# Altium project Tray2.PrjPcb
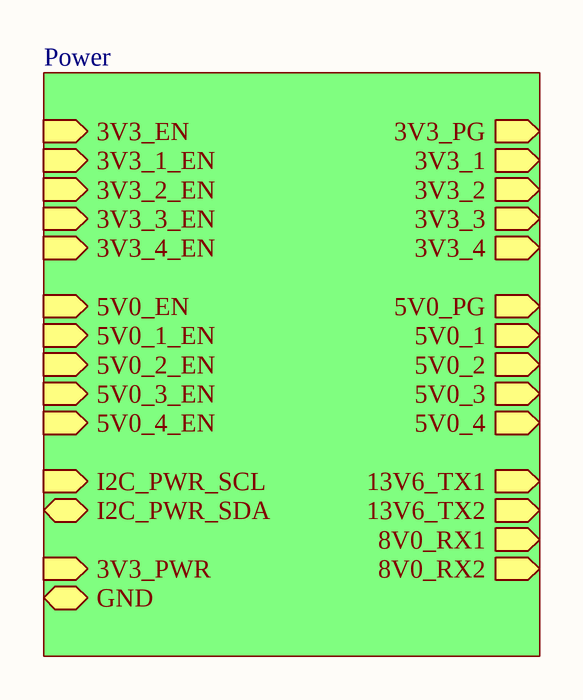
[diagram p0: Top.SchDoc]
7 sheets, 367 parts. Net scope: strictly hierarchical (ports join the sheet entries above them; power ports are local).
Sheets:
  Top.SchDoc
    Power = Power.SchDoc
      LDO_5V0_1 = LDO_Regulator.SchDoc
      LDO_3V3_1 = LDO_Regulator.SchDoc
      LDO_5V0_2 = LDO_Regulator.SchDoc
      LDO_3V3_2 = LDO_Regulator.SchDoc
      LDO_5V0_3 = LDO_Regulator.SchDoc
      LDO_3V3_3 = LDO_Regulator.SchDoc
      LDO_5V0_4 = LDO_Regulator.SchDoc
      LDO_3V3_4 = LDO_Regulator.SchDoc
      SW_5V0 = SW_Regulator.SchDoc
      SW_3V3 = SW_Regulator.SchDoc
      TRX1 = TRX_Regulator.SchDoc
      TRX2 = TRX_Regulator.SchDoc
      BCR = BCR.SchDoc
        X+ = BCR_Unit.SchDoc
        Y+ = BCR_Unit.SchDoc
        Z+ = BCR_Unit.SchDoc
        X- = BCR_Unit.SchDoc
        Y- = BCR_Unit.SchDoc
        Z- = BCR_Unit.SchDoc

## Sheet Top.SchDoc
size A4

### Sub-sheets
Power = Power.SchDoc: 5V0_1 (out), 3V3_1 (out), 5V0_2 (out), 3V3_2 (out), 5V0_3 (out), 3V3_3 (out), 5V0_4 (out), 3V3_4 (out), 5V0_PG (out), 3V3_PG (out), GND, 13V6_TX1 (out), 8V0_RX1 (out), 13V6_TX2 (out), 8V0_RX2 (out), 5V0_EN (in), 3V3_EN (in), 5V0_1_EN (in), 5V0_2_EN (in), 5V0_3_EN (in), 5V0_4_EN (in), 3V3_1_EN (in), 3V3_2_EN (in), 3V3_3_EN (in), 3V3_4_EN (in), I2C_PWR_SCL (in), I2C_PWR_SDA (bidir), 3V3_PWR (in)

## Sheet Power.SchDoc
size A3; Description: Power Subsystem; Version: 1.0
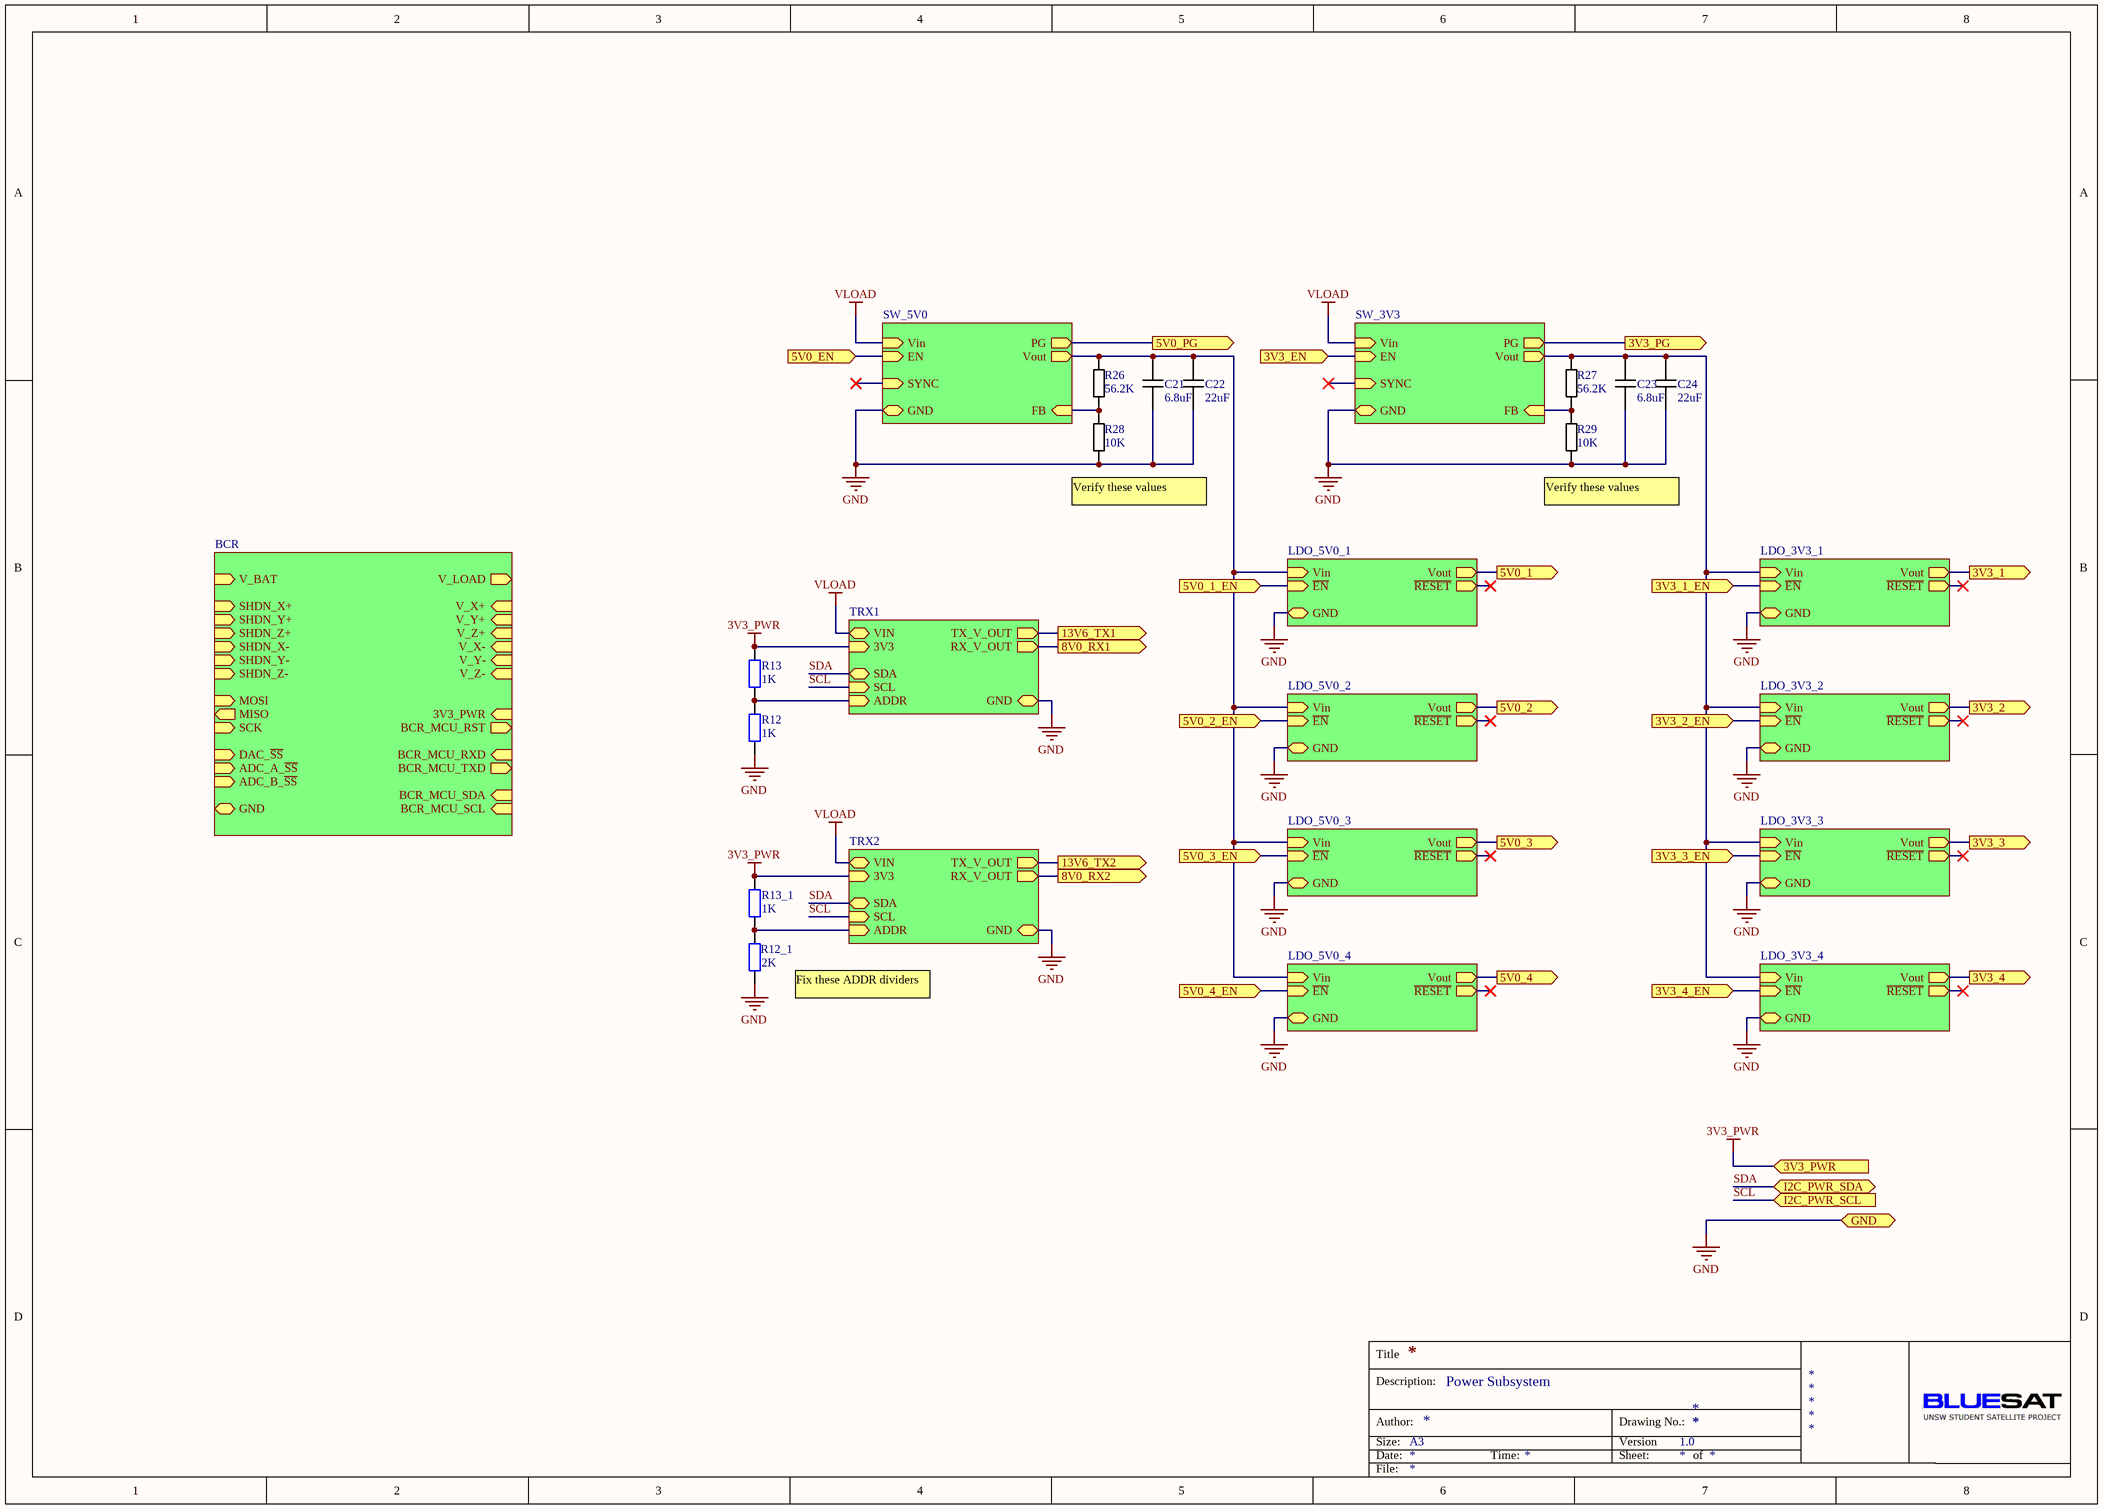
[diagram p1: Power.SchDoc]

### Parts
(Parts that share a designator on the sheet are numbered #1, #2 ... from top to bottom, then left to right.)
C21#1  value 6.8uF  [0805 Cap]  (hidden comment: 0805 Cap)
C22#1  value 22uF  [1206 Cap]  (hidden comment: 1206 Cap)
C23#1  value 6.8uF  [0805 Cap]  (hidden comment: 0805 Cap)
C24#1  value 22uF  [1206 Cap]  (hidden comment: 1206 Cap)
R12#1  value 1K  [R0805M]  (hidden comment: Res2)
R12_1  value 2K  [R0805M]  (hidden comment: Res2)
R13#1  value 1K  [R0805M]  (hidden comment: Res2)
R13_1  value 1K  [R0805M]  (hidden comment: Res2)
R26  value 56.2K  [0805 Resistor]  (hidden comment: 0805 Resistor)
R27  value 56.2K  [0805 Resistor]  (hidden comment: 0805 Resistor)
R28  value 10K  [0805 Resistor]  (hidden comment: 0805 Resistor)
R29  value 10K  [0805 Resistor]  (hidden comment: 0805 Resistor)

### Sub-sheets
BCR = BCR.SchDoc: 3V3_PWR (in), V_BAT (in), V_LOAD (out), V_X+ (in), V_Y+ (in), V_Z+ (in), V_X- (in), V_Y- (in), V_Z- (in), SHDN_X+ (in), SHDN_Y+ (in), SHDN_Z+ (in), SHDN_X- (in), SHDN_Y- (in), SHDN_Z- (in), MOSI (in), MISO (out), SCK (in), DAC_~{SS} (in), ADC_A_~{SS} (in), ADC_B_~{SS} (in), BCR_MCU_SDA (in), BCR_MCU_SCL (in), BCR_MCU_RXD (in), BCR_MCU_TXD (out), BCR_MCU_RST (out), GND
LDO_3V3_1 = LDO_Regulator.SchDoc: Vout (out), ~{EN} (in), ~{RESET} (out), Vin (in), GND
LDO_3V3_2 = LDO_Regulator.SchDoc: Vout (out), ~{EN} (in), ~{RESET} (out), Vin (in), GND
LDO_3V3_3 = LDO_Regulator.SchDoc: Vout (out), ~{EN} (in), ~{RESET} (out), Vin (in), GND
LDO_3V3_4 = LDO_Regulator.SchDoc: Vout (out), ~{EN} (in), ~{RESET} (out), Vin (in), GND
LDO_5V0_1 = LDO_Regulator.SchDoc: Vout (out), ~{EN} (in), ~{RESET} (out), Vin (in), GND
LDO_5V0_2 = LDO_Regulator.SchDoc: Vout (out), ~{EN} (in), ~{RESET} (out), Vin (in), GND
LDO_5V0_3 = LDO_Regulator.SchDoc: Vout (out), ~{EN} (in), ~{RESET} (out), Vin (in), GND
LDO_5V0_4 = LDO_Regulator.SchDoc: Vout (out), ~{EN} (in), ~{RESET} (out), Vin (in), GND
SW_3V3 = SW_Regulator.SchDoc: PG (out), Vout (out), EN (in), Vin (in), SYNC (in), GND, FB (in)
SW_5V0 = SW_Regulator.SchDoc: PG (out), Vout (out), EN (in), Vin (in), SYNC (in), GND, FB (in)
TRX1 = TRX_Regulator.SchDoc: VIN, TX_V_OUT (out), RX_V_OUT (out), 3V3 (in), SCL (in), SDA (bidir), GND, ADDR (in)
TRX2 = TRX_Regulator.SchDoc: VIN, TX_V_OUT (out), RX_V_OUT (out), 3V3 (in), SCL (in), SDA (bidir), GND, ADDR (in)

### Ports
3V3_1 (out), 3V3_1_EN (in), 3V3_2 (out), 3V3_2_EN (in), 3V3_3 (out), 3V3_3_EN (in), 3V3_4 (out), 3V3_4_EN (in), 3V3_EN (in), 3V3_PG (out), 3V3_PWR (in), 5V0_1 (out), 5V0_1_EN (in), 5V0_2 (out), 5V0_2_EN (in), 5V0_3 (out), 5V0_3_EN (in), 5V0_4 (out), 5V0_4_EN (in), 5V0_EN (in), 5V0_PG (out), 8V0_RX1 (out), 8V0_RX2 (out), 13V6_TX1 (out), 13V6_TX2 (out), GND, I2C_PWR_SCL (in), I2C_PWR_SDA (bidir)

### Nets
3V3_PWR: R13#1.2 R13_1.2 ; port 3V3_PWR, sheet TRX1/3V3, sheet TRX2/3V3
GND: C21#1.1 C22#1.1 C23#1.1 C24#1.1 R12#1.1 R12_1.1 R28.1 R29.1 ; port GND, sheet LDO_5V0_1/GND, sheet LDO_3V3_1/GND, sheet LDO_5V0_2/GND, sheet LDO_3V3_2/GND, sheet LDO_5V0_3/GND, sheet LDO_3V3_3/GND, sheet LDO_5V0_4/GND, sheet LDO_3V3_4/GND, sheet SW_5V0/GND, sheet SW_3V3/GND, sheet TRX1/GND, sheet TRX2/GND
VLOAD: sheet SW_5V0/Vin, sheet SW_3V3/Vin, sheet TRX1/VIN, sheet TRX2/VIN  [project net V_IN]
EN_SW_3V3: port 3V3_EN, sheet SW_3V3/EN
EN_SW_5V0: port 5V0_EN, sheet SW_5V0/EN
FB: R26.1 R28.2 ; sheet SW_5V0/FB
FB: R27.1 R29.2 ; sheet SW_3V3/FB  [a separate net that carries the same name]
PG_SW_3V3: port 3V3_PG, sheet SW_3V3/PG
PG_SW_5V0: port 5V0_PG, sheet SW_5V0/PG
RX_V_OUT_TRX1: port 8V0_RX1, sheet TRX1/RX_V_OUT
RX_V_OUT_TRX2: port 8V0_RX2, sheet TRX2/RX_V_OUT
SCL: port I2C_PWR_SCL, sheet TRX1/SCL, sheet TRX2/SCL
SDA: port I2C_PWR_SDA, sheet TRX1/SDA, sheet TRX2/SDA
TX_V_OUT_TRX1: port 13V6_TX1, sheet TRX1/TX_V_OUT
TX_V_OUT_TRX2: port 13V6_TX2, sheet TRX2/TX_V_OUT
Vout: C21#1.2 C22#1.2 R26.2 ; sheet LDO_5V0_1/Vin, sheet LDO_5V0_2/Vin, sheet LDO_5V0_3/Vin, sheet LDO_5V0_4/Vin, sheet SW_5V0/Vout
Vout: C23#1.2 C24#1.2 R27.2 ; sheet LDO_3V3_1/Vin, sheet LDO_3V3_2/Vin, sheet LDO_3V3_3/Vin, sheet LDO_3V3_4/Vin, sheet SW_3V3/Vout  [a separate net that carries the same name]
NetC2_LDO_3V3_1_2: port 3V3_1, sheet LDO_3V3_1/Vout
NetC2_LDO_3V3_2_2: port 3V3_2, sheet LDO_3V3_2/Vout
NetC2_LDO_3V3_3_2: port 3V3_3, sheet LDO_3V3_3/Vout
NetC2_LDO_3V3_4_2: port 3V3_4, sheet LDO_3V3_4/Vout
NetC2_LDO_5V0_1_2: port 5V0_1, sheet LDO_5V0_1/Vout
NetC2_LDO_5V0_2_2: port 5V0_2, sheet LDO_5V0_2/Vout
NetC2_LDO_5V0_3_2: port 5V0_3, sheet LDO_5V0_3/Vout
NetC2_LDO_5V0_4_2: port 5V0_4, sheet LDO_5V0_4/Vout
NetR12#1_2: R12#1.2 R13#1.1 ; sheet TRX1/ADDR
NetR12_1_2: R12_1.2 R13_1.1 ; sheet TRX2/ADDR
NetU1_LDO_3V3_1_5: port 3V3_1_EN, sheet LDO_3V3_1/~{EN}
NetU1_LDO_3V3_2_5: port 3V3_2_EN, sheet LDO_3V3_2/~{EN}
NetU1_LDO_3V3_3_5: port 3V3_3_EN, sheet LDO_3V3_3/~{EN}
NetU1_LDO_3V3_4_5: port 3V3_4_EN, sheet LDO_3V3_4/~{EN}
NetU1_LDO_5V0_1_5: port 5V0_1_EN, sheet LDO_5V0_1/~{EN}
NetU1_LDO_5V0_2_5: port 5V0_2_EN, sheet LDO_5V0_2/~{EN}
NetU1_LDO_5V0_3_5: port 5V0_3_EN, sheet LDO_5V0_3/~{EN}
NetU1_LDO_5V0_4_5: port 5V0_4_EN, sheet LDO_5V0_4/~{EN}

### Notes on the sheet
- (near R28) Verify these values
- (near R29) Verify these values
- (near R12_1) Fix these ADDR dividers
- Title
- Description:
- Size:
- Author:
- Date:
- A3
- Time:
- Version
- Sheet:
- Drawing No.:
- of
- File:

### Library data of the parts
C21#1 C23#1 = 0805 MLCC - X7R, 10%
C22#1 C24#1 = 1206 MLCC - X7R, 10%
R12#1 R12_1 R13#1 R13_1 = Res2: Resistor; Published: 8-Jun-2000; LatestRevisionDate: 17-Jul-2002; LatestRevisionNote: Re-released for DXP Platform.; PackageReference: AXIAL-0.4; Publisher: Altium Limited
R26-R29 = 0805 Thick Film Resistor 1%

## Sheet LDO_Regulator.SchDoc: 3V3/5V0 Low Drop Out Linear Regulator
size A3; Description: Based on LDO-BASE.SchDoc SVN Rev 73; Version: 1.0
Used 8 times, as channels Power/LDO_5V0_1, Power/LDO_3V3_1, Power/LDO_5V0_2, Power/LDO_3V3_2, Power/LDO_5V0_3, Power/LDO_3V3_3, Power/LDO_5V0_4, Power/LDO_3V3_4. Parts and nets are listed once, with the designators drawn on the sheet.
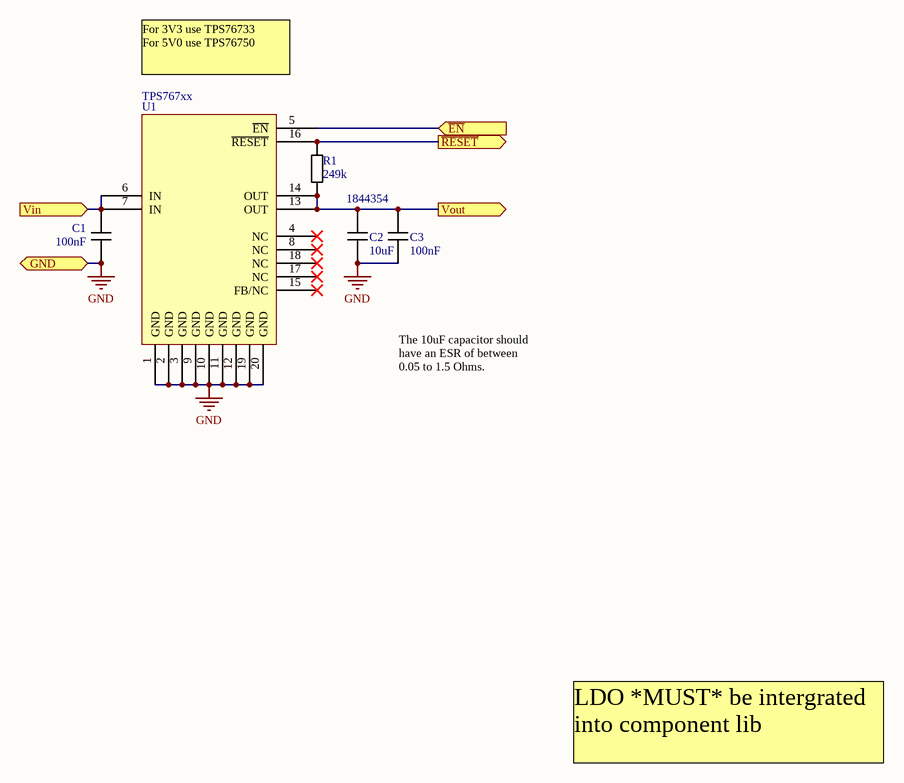
[diagram p2: LDO_Regulator.SchDoc]

### Parts
C1  value 100nF  [0805 Cap]  (hidden comment: 0805 Cap)
C2  value 10uF  Supplier Part Number 1: 1844354  [1210 Cap]  (hidden comment: 1210 Cap)
C3  value 100nF  [0805 Cap]  (hidden comment: 0805 Cap)
R1  value 249k  [0805 Resistor]  (hidden comment: 0805 Resistor)
U1  TPS767xx  [SOP-20 TPS76700]

### Ports
GND, Vin (in), Vout (out), ~{EN} (in), ~{RESET} (out)

### Nets
GND: C1.1 C2.1 C3.1 U1.1(GND) U1.2(GND) U1.3(GND) U1.9(GND) U1.10(GND) U1.11(GND) U1.12(GND) U1.19(GND) U1.20(GND) ; port GND
~{EN}: U1.5(~{EN}) ; port ~{EN}
~{RESET}: R1.2 U1.16(~{RESET}) ; port ~{RESET}
Vin: C1.2 U1.6(IN) U1.7(IN) ; port Vin
Vout: C2.2 C3.2 R1.1 U1.13(OUT) U1.14(OUT) ; port Vout

Not connected (* = marked no-connect by the designer): U1 4(NC)* 8(NC)* 15(FB/NC)* 17(NC)* 18(NC)*

### Channels
Power/LDO_5V0_1: designators end in _LDO_5V0_1; ports GND=GND Vin=Vout Vout=NetC2_LDO_5V0_1_2 ~{EN}=NetU1_LDO_5V0_1_5 ~{RESET}=NetR1_LDO_5V0_1_2
Power/LDO_3V3_1: designators end in _LDO_3V3_1; ports GND=GND Vin=Vout Vout=NetC2_LDO_3V3_1_2 ~{EN}=NetU1_LDO_3V3_1_5 ~{RESET}=NetR1_LDO_3V3_1_2
Power/LDO_5V0_2: designators end in _LDO_5V0_2; ports GND=GND Vin=Vout Vout=NetC2_LDO_5V0_2_2 ~{EN}=NetU1_LDO_5V0_2_5 ~{RESET}=NetR1_LDO_5V0_2_2
Power/LDO_3V3_2: designators end in _LDO_3V3_2; ports GND=GND Vin=Vout Vout=NetC2_LDO_3V3_2_2 ~{EN}=NetU1_LDO_3V3_2_5 ~{RESET}=NetR1_LDO_3V3_2_2
Power/LDO_5V0_3: designators end in _LDO_5V0_3; ports GND=GND Vin=Vout Vout=NetC2_LDO_5V0_3_2 ~{EN}=NetU1_LDO_5V0_3_5 ~{RESET}=NetR1_LDO_5V0_3_2
Power/LDO_3V3_3: designators end in _LDO_3V3_3; ports GND=GND Vin=Vout Vout=NetC2_LDO_3V3_3_2 ~{EN}=NetU1_LDO_3V3_3_5 ~{RESET}=NetR1_LDO_3V3_3_2
Power/LDO_5V0_4: designators end in _LDO_5V0_4; ports GND=GND Vin=Vout Vout=NetC2_LDO_5V0_4_2 ~{EN}=NetU1_LDO_5V0_4_5 ~{RESET}=NetR1_LDO_5V0_4_2
Power/LDO_3V3_4: designators end in _LDO_3V3_4; ports GND=GND Vin=Vout Vout=NetC2_LDO_3V3_4_2 ~{EN}=NetU1_LDO_3V3_4_5 ~{RESET}=NetR1_LDO_3V3_4_2

### Notes on the sheet
- For 3V3 use TPS76733
  For 5V0 use TPS76750
- The 10uF capacitor should have an ESR of between 0.05 to 1.5 Ohms.
- LDO *MUST* be intergrated into component lib
- Title
- Description:
- Size:
- Author:
- Date:
- A3
- Time:
- Version
- Sheet:
- Drawing No.:
- of
- File:

### Library data of the parts
C1 C3 = 0805 MLCC - X7R, 10%
C2 = 1210 MLCC - X7R, 10%: Supplier 1: Farnell
R1 = 0805 Thick Film Resistor 1%
U1 = TPS76700: LDO Regulator - ER; Supplier 1: Farnell; Supplier Part Number 1: 1135436; Supplier 2: Farnell; Supplier Part Number 2: 1135435

## Sheet SW_Regulator.SchDoc: 5V/3V3 Switching Regulator LV
size A3; Description: Based on Switching_Regulator_LV.SchDoc SVN Rev 73; Version: 1.0
Used 2 times, as channels Power/SW_5V0, Power/SW_3V3. Parts and nets are listed once, with the designators drawn on the sheet.
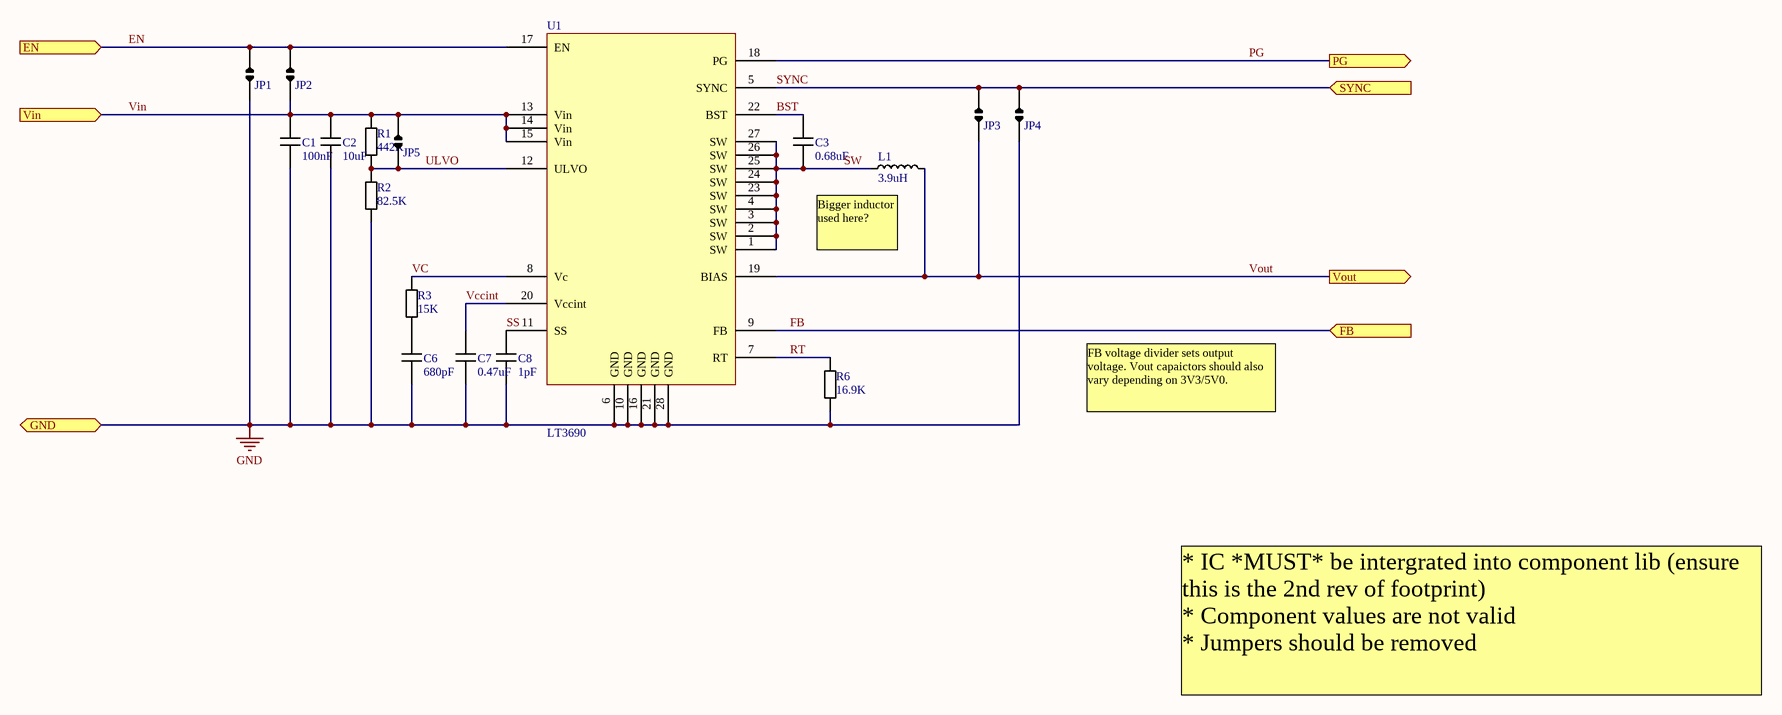
[diagram p3: SW_Regulator.SchDoc]

### Parts
C1  value 100nF  [0805 Cap]  (hidden comment: 0805 Cap)
C2  value 10uF  [1206 Cap]  (hidden comment: 1206 Cap)
C3  value 0.68uF  [0805 Cap]  (hidden comment: 0805 Cap)
C6  value 680pF  [0805 Cap]  (hidden comment: 0805 Cap)
C7  value 0.47uF  [0805 Cap]  (hidden comment: 0805 Cap)
C8  value 1pF  [0805 Cap]  (hidden comment: 0805 Cap)
JP1  Jumper  [Solder Jumper C]  (value not drawn)
JP2  Jumper  [Solder Jumper C]  (value not drawn)
JP3  Jumper  [Solder Jumper C]  (value not drawn)
JP4  Jumper  [Solder Jumper C]  (value not drawn)
JP5  Jumper  [Solder Jumper C]  (value not drawn)
L1  value 3.9uH  [INDP4037X16N]  (hidden comment: LQH44PN2R2MP0)
R1  value 442K  [0805 Resistor]  (hidden comment: 0805 Resistor)
R2  value 82.5K  [0805 Resistor]  (hidden comment: 0805 Resistor)
R3  value 15K  [0805 Resistor]  (hidden comment: 0805 Resistor)
R6  value 16.9K  [0805 Resistor]  (hidden comment: 0805 Resistor)
U1  LT3690  [LT3690]

### Ports
EN (in), FB (in), GND, PG (out), SYNC (in), Vin (in), Vout (out)

### Nets
GND: C1.1 C2.1 C6.1 C7.1 C8.1 JP1.2 JP4.2 R2.1 R6.1 U1.6(GND) U1.10(GND) U1.16(GND) U1.21(GND) U1.28(GND) ; port GND
BST: C3.2 U1.22(BST)
EN: JP1.1 JP2.1 U1.17(EN) ; port EN
FB: U1.9(FB) ; port FB
PG: U1.18(PG) ; port PG
RT: R6.2 U1.7(RT)
SS: C8.2 U1.11(SS)
SW: C3.1 L1.1 U1.1(SW) U1.2(SW) U1.3(SW) U1.4(SW) U1.23(SW) U1.24(SW) U1.25(SW) U1.26(SW) U1.27(SW)
SYNC: JP3.1 JP4.1 U1.5(SYNC) ; port SYNC
ULVO: JP5.2 R1.1 R2.2 U1.12(ULVO)
VC: R3.2 U1.8(Vc)
Vccint: C7.2 U1.20(Vccint)
Vin: C1.2 C2.2 JP2.2 JP5.1 R1.2 U1.13(Vin) U1.14(Vin) U1.15(Vin) ; port Vin
Vout: JP3.2 L1.2 U1.19(BIAS) ; port Vout
NetC6_2: C6.2 R3.1

### Channels
Power/SW_5V0: designators end in _SW_5V0; ports EN=EN_SW_5V0 FB=FB GND=GND PG=PG_SW_5V0 SYNC=SYNC_SW_5V0 Vin=V_IN Vout=Vout
Power/SW_3V3: designators end in _SW_3V3; ports EN=EN_SW_3V3 FB=FB GND=GND PG=PG_SW_3V3 SYNC=SYNC_SW_3V3 Vin=V_IN Vout=Vout

### Notes on the sheet
- (near L1) Bigger inductor used here?
- FB voltage divider sets output voltage. Vout capaictors should also vary depending on 3V3/5V0.
- * IC *MUST* be intergrated into component lib (ensure this is the 2nd rev of footprint)
  * Component values are not valid
  * Jumpers should be removed
- Title
- Description:
- Size:
- Author:
- Date:
- A3
- Time:
- Version
- Sheet:
- Drawing No.:
- of
- File:

### Library data of the parts
C1 C3 C7 = 0805 MLCC - X7R, 10%
C2 = 1206 MLCC - X7R, 10%
C6 C8 = 0805 MLCC - NP0, 5%
JP1-JP5 = Solder Bridge
L1 = LQH44PN2R2MP0: Inductor 4x4mm 2.2uH; ComponentLink1Description: Datasheet; ComponentLink1URL: http://search.murata.co.jp/Ceramy/image/img/PDF/ENG/L0075S0103LQH44P.pdf
R1-R3 R6 = 0805 Thick Film Resistor 1%

## Sheet TRX_Regulator.SchDoc: TX & RX Radio Pair Regulator
size A3; Engineer: C. BROWN; Organization: BLUEsat Project; Address1: Room 419; Address2: School of EE&T; Address3: UNSW, NSW 2052; Address4: Australia; DocumentNumber: TITL0002; SheetNumber: 1; SheetTotal: 1; Description: Based on POWR0009.SchDoc SVN Rev 93; Version: 2.0
Used 2 times, as channels Power/TRX1, Power/TRX2. Parts and nets are listed once, with the designators drawn on the sheet.
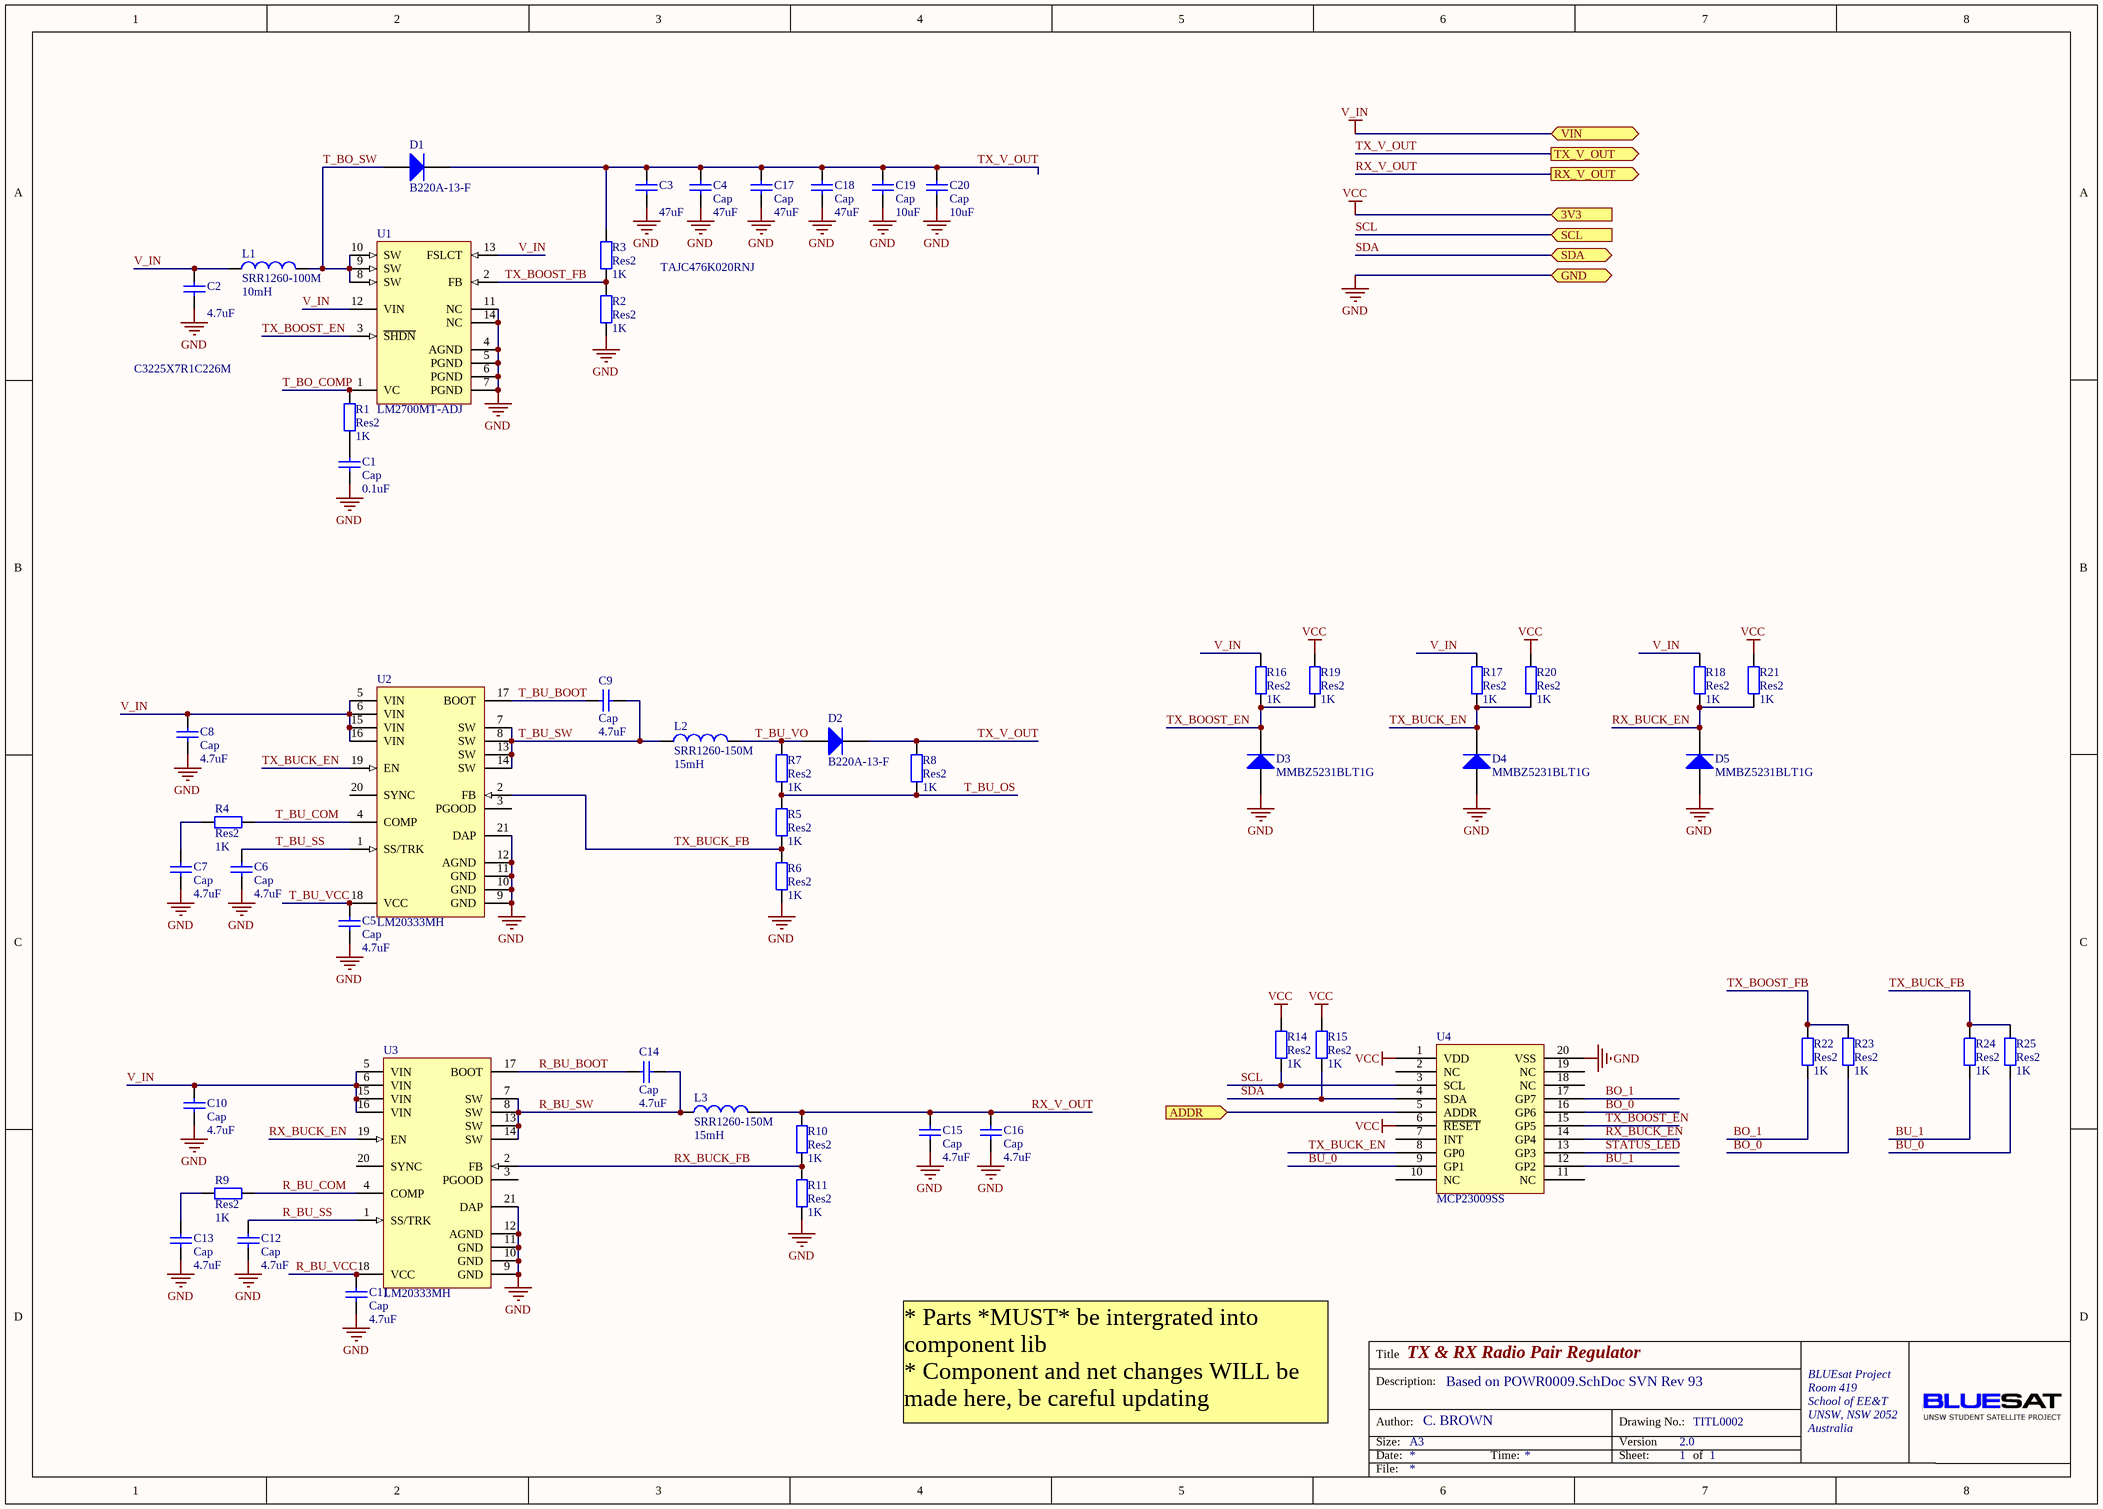
[diagram p4: TRX_Regulator.SchDoc]

### Parts
C1  Cap  value 0.1uF  [R0805M]
C2  C3225X7R1C226M  value 4.7uF  [R1210M]
C3  TAJC476K020RNJ  value 47uF  [TANTCASEC]
C4  Cap  value 47uF  [TANTCASEC]
C5  Cap  value 4.7uF  [R0805M]
C6  Cap  value 4.7uF  [R0805M]
C7  Cap  value 4.7uF  [R0805M]
C8  Cap  value 4.7uF  [R1210M]
C9  Cap  value 4.7uF  [R0805M]
C10  Cap  value 4.7uF  [R1210M]
C11  Cap  value 4.7uF  [R0805M]
C12  Cap  value 4.7uF  [R0805M]
C13  Cap  value 4.7uF  [R0805M]
C14  Cap  value 4.7uF  [R0805M]
C15  Cap  value 4.7uF  [R0805M]
C16  Cap  value 4.7uF  [R0805M]
C17  Cap  value 47uF  [TANTCASEC]
C18  Cap  value 47uF  [TANTCASEC]
C19  Cap  value 10uF  [R0805M]
C20  Cap  value 10uF  [R0805M]
D1  B220A-13-F  [DIODESMA]
D2  B220A-13-F  [DIODESMA]
D3  MMBZ5231BLT1G  [SOT95P240-3N]
D4  MMBZ5231BLT1G  [SOT95P240-3N]
D5  MMBZ5231BLT1G  [SOT95P240-3N]
L1  SRR1260-100M  value 10mH  [SRR1260M]
L2  SRR1260-150M  value 15mH  [SRR1260M]
L3  SRR1260-150M  value 15mH  [SRR1260M]
R1  Res2  value 1K  [R0805M]
R2  Res2  value 1K  [R0805M]
R3  Res2  value 1K  [R0805M]
R4  Res2  value 1K  [R0805M]
R5  Res2  value 1K  [R0805M]
R6  Res2  value 1K  [R0805M]
R7  Res2  value 1K  [R0805M]
R8  Res2  value 1K  [R0805M]
R9  Res2  value 1K  [R0805M]
R10  Res2  value 1K  [R0805M]
R11  Res2  value 1K  [R0805M]
R14  Res2  value 1K  [R0805M]
R15  Res2  value 1K  [R0805M]
R16  Res2  value 1K  [R0805M]
R17  Res2  value 1K  [R0805M]
R18  Res2  value 1K  [R0805M]
R19  Res2  value 1K  [R0805M]
R20  Res2  value 1K  [R0805M]
R21  Res2  value 1K  [R0805M]
R22  Res2  value 1K  [R0805M]
R23  Res2  value 1K  [R0805M]
R24  Res2  value 1K  [R0805M]
R25  Res2  value 1K  [R0805M]
U1  LM2700MT-ADJ  [MTC14_N]
U2  LM20333MH  [MXA20A_N]
U3  LM20333MH  [MXA20A_N]
U4  MCP23009SS  [SSOP-SS20_M]

### Ports
3V3 (in), ADDR (in), GND, RX_V_OUT (out), SCL (in), SDA (bidir), TX_V_OUT (out), VIN

### Nets
GND: C1.1 C2.1 C3.1 C4.1 C5.1 C6.1 C7.1 C8.1 C10.1 C11.1 C12.1 C13.1 C15.1 C16.1 C17.1 C18.1 C19.1 C20.1 D3.1(A) D4.1(A) D5.1(A) R2.1 R6.2 R11.1 U1.4(AGND) U1.5(PGND) U1.6(PGND) U1.7(PGND) U1.11(NC) U1.14(NC) U2.9(GND) U2.10(GND) U2.11(GND) U2.12(AGND) U2.21(DAP) U3.9(GND) U3.10(GND) U3.11(GND) U3.12(AGND) U3.21(DAP) U4.20(VSS) ; port GND
V_IN: C2.2 C8.2 C10.2 L1.1 R16.2 R17.2 R18.2 U1.12(VIN) U1.13(FSLCT) U2.5(VIN) U2.6(VIN) U2.15(VIN) U2.16(VIN) U3.5(VIN) U3.6(VIN) U3.15(VIN) U3.16(VIN) ; port VIN
VCC: R14.2 R15.2 R19.2 R20.2 R21.2 U4.1(VDD) U4.6(~{RESET}) ; port 3V3
ADDR: U4.5(ADDR) ; port ADDR
BO_0: R23.1 U4.16(GP6)
BO_1: R22.1 U4.17(GP7)
BU_0: R25.1 U4.9(GP1)
BU_1: R24.1 U4.12(GP2)
R_BU_BOOT: C14.1 U3.17(BOOT)
R_BU_COM: R9.1 U3.4(COMP)
R_BU_SS: C12.2 U3.1(SS/TRK)
R_BU_SW: C14.2 L3.1 U3.7(SW) U3.8(SW) U3.13(SW) U3.14(SW)
R_BU_VCC: C11.2 U3.18(VCC)
RX_BUCK_EN: D5.3(K) R18.1 R21.1 U3.19(EN) U4.14(GP4)
RX_BUCK_FB: R10.1 R11.2 U3.2(FB)
RX_V_OUT: C15.2 C16.2 L3.2 R10.2 ; port RX_V_OUT
SCL: R14.1 U4.3(SCL) ; port SCL
SDA: R15.1 U4.4(SDA) ; port SDA
STATUS_LED: U4.13(GP3)
T_BO_COMP: R1.2 U1.1(VC)
T_BO_SW: D1.1(A) L1.2 U1.8(SW) U1.9(SW) U1.10(SW)
T_BU_BOOT: C9.2 U2.17(BOOT)
T_BU_COM: R4.1 U2.4(COMP)
T_BU_OS: R5.1 R7.2 R8.2
T_BU_SS: C6.2 U2.1(SS/TRK)
T_BU_SW: C9.1 L2.1 U2.7(SW) U2.8(SW) U2.13(SW) U2.14(SW)
T_BU_VCC: C5.2 U2.18(VCC)
T_BU_VO: D2.1(A) L2.2 R7.1
TX_BOOST_EN: D3.3(K) R16.1 R19.1 U1.3(~{SHDN}) U4.15(GP5)
TX_BOOST_FB: R2.2 R3.1 R22.2 R23.2 U1.2(FB)
TX_BUCK_EN: D4.3(K) R17.1 R20.1 U2.19(EN) U4.8(GP0)
TX_BUCK_FB: R5.2 R6.1 R24.2 R25.2 U2.2(FB)
TX_V_OUT: C3.2 C4.2 C17.2 C18.2 C19.2 C20.2 D1.2(K) D2.2(K) R3.2 R8.1 ; port TX_V_OUT
NetC1_2: C1.2 R1.1
NetC7_2: C7.2 R4.2
NetC13_2: C13.2 R9.2

Not connected (* = marked no-connect by the designer): U2 3(PGOOD) 20(SYNC); U3 3(PGOOD) 20(SYNC); U4 2(NC) 7(INT) 10(NC) 11(NC) 18(NC) 19(NC)

### Channels
Power/TRX1: designators end in _TRX1; ports 3V3=3V3_PWR ADDR=NetR12#1_2 GND=GND RX_V_OUT=RX_V_OUT_TRX1 SCL=SCL SDA=SDA TX_V_OUT=TX_V_OUT_TRX1 VIN=V_IN
Power/TRX2: designators end in _TRX2; ports 3V3=3V3_PWR ADDR=NetR12_1_2 GND=GND RX_V_OUT=RX_V_OUT_TRX2 SCL=SCL SDA=SDA TX_V_OUT=TX_V_OUT_TRX2 VIN=V_IN

### Notes on the sheet
- Title
- Description:
- * Parts *MUST* be intergrated into component lib
  * Component and net changes WILL be made here, be careful updating
- Size:
- Author:
- Date:
- A3
- Time:
- Version
- Sheet:
- Drawing No.:
- of
- File:

### Library data of the parts
C1-C20 = Cap: Capacitor; Published: 8-Jun-2000; LatestRevisionDate: 17-Jul-2002; LatestRevisionNote: Re-released for DXP Platform.; PackageReference: RAD-0.3; Publisher: Altium Limited
D1 D2 = Diode 1N4148: High Conductance Fast Diode; Published: 8-Jun-2000; LatestRevisionDate: 17-Jul-2002; LatestRevisionNote: Re-released for DXP Platform.; DatasheetVersion: 1997; PackageReference: DO-35; Publisher: Altium Limited; Code_JEDEC: DO-204-AH; ComponentLink1Description: Manufacturer Link; ComponentLink1URL: http://www.fairchildsemi.com/; ComponentLink2Description: Datasheet; ComponentLink2URL: http://www.fairchildsemi.com/ds/1N%2F1N4148.pdf
D3-D5 = Diode BAS16: Silicon Switching Diode for High-Speed Switching; Note: Pin 2 is not connected and not drawn.; Published: 21-Mar-2003; LatestRevisionDate: 29-May-2009; LatestRevisionNote: IPC-7351 Footprint Added.; DatasheetVersion: Oct-1999; PackageVersion: Sep-2001; PackageReference: SOT-23; Publisher: Altium Limited; PackageDescription: 3-Pin SOT-23 Package 0.95 mm Pitch, 2.5 mm Lead Span; ComponentLink1Description: Manufacturer Link; ComponentLink1URL: http://www.infineon.com/; ComponentLink2Description: Datasheet; ComponentLink2URL: http://www.infineon.com/upload/Document/cmc_upload/documents/012/5331/bas16series.pdf
L1-L3 = Inductor: Code_IEC: 1005; Published: 8-Jun-2000; LatestRevisionDate: 29-May-2009; LatestRevisionNote: IPC-7351 Footprint Added.; PackageReference: 0402-A; Publisher: Altium Limited; PackageDescription: Chip Inductor; Code_JEITA: 0402
R1-R11 R14-R25 = Res2: Resistor; Published: 8-Jun-2000; LatestRevisionDate: 17-Jul-2002; LatestRevisionNote: Re-released for DXP Platform.; PackageReference: AXIAL-0.4; Publisher: Altium Limited
U1 = LM2700MT-ADJ: 600kHz/1.25MHz, 2.5A, Step-up PWM DC/DC Converter; Manufacturer: National Semiconductor; CompType: Switcher; PackageTopMarking: NSZXYTT*2700MT*-ADJ; PowerWise: N; Published: 4-Dec-2008; DatasheetVersion: May-2004; PackageVersion: revD, Jun-2003; PackageReference: MTC14; Publisher: Altium Limited; PackageDescription: Molded TSSOP, JEDEC, 5 x 4.4 x 0.9mm Body, 14 Lead, 0.65mm Pitch; PartNumber: LM2700MT-ADJ; RoHS: O; PinCount: 14; DigiKeyPartNumber: LM2700MT-ADJ-ND; Code_JEDEC: MO-153-AB-1; ComponentLink1Description: LM2700 Datasheet; ComponentLink1URL: http://www.national.com/ds/LM/LM2700.pdf; ComponentLink2Description: LM2700 Web Page; ComponentLink2URL: http://www.national.com/pf/LM/LM2700.html; ComponentLink3Description: MTC14 Package Drawing; ComponentLink3URL: http://www.national.com/packaging/folders/mtc14.html
U2 U3 = LM20333MH: 36V, 3A PowerWise Synchronous Buck Regulator with Frequency Synchronization; Manufacturer: National Semiconductor; CompType: Switcher; PackageTopMarking: NSUZXYTT*20333MH; Published: 4-Dec-2008; DatasheetVersion: Jun-2008; PackageVersion: revC, Jul-2006; PackageReference: MXA20A; Publisher: Altium Limited; PackageDescription: Molded TSSOP, Jedec, 6.5 x 4.4 x 0.9mm Body, 20 Lead, 0.65mm Pitch, Exposed Pad; PartNumber: LM20333MH; RoHS: Y; PinCount: 20; DigiKeyPartNumber: LM20333MH-ND; Code_JEDEC: MO-153-ACT; ComponentLink1Description: LM20333 Datasheet; ComponentLink1URL: http://www.national.com/ds/LM/LM20333.pdf; ComponentLink2Description: LM20333 Web Page; ComponentLink2URL: http://www.national.com/pf/LM/LM20333.html; ComponentLink3Description: MXA20A Package Drawing; ComponentLink3URL: http://www.national.com/packaging/folders/mxa20a.html

## Sheet BCR.SchDoc: BLUEsat Battery Charge Regulator System
size A3; Engineer: Thomas Fisk; Organization: BLUEsat Project; DocumentNumber: POWR0008; SheetNumber: 1; SheetTotal: 1; Description: Controls charging of batteries, MPPT, provides telem data; Version: 1.0
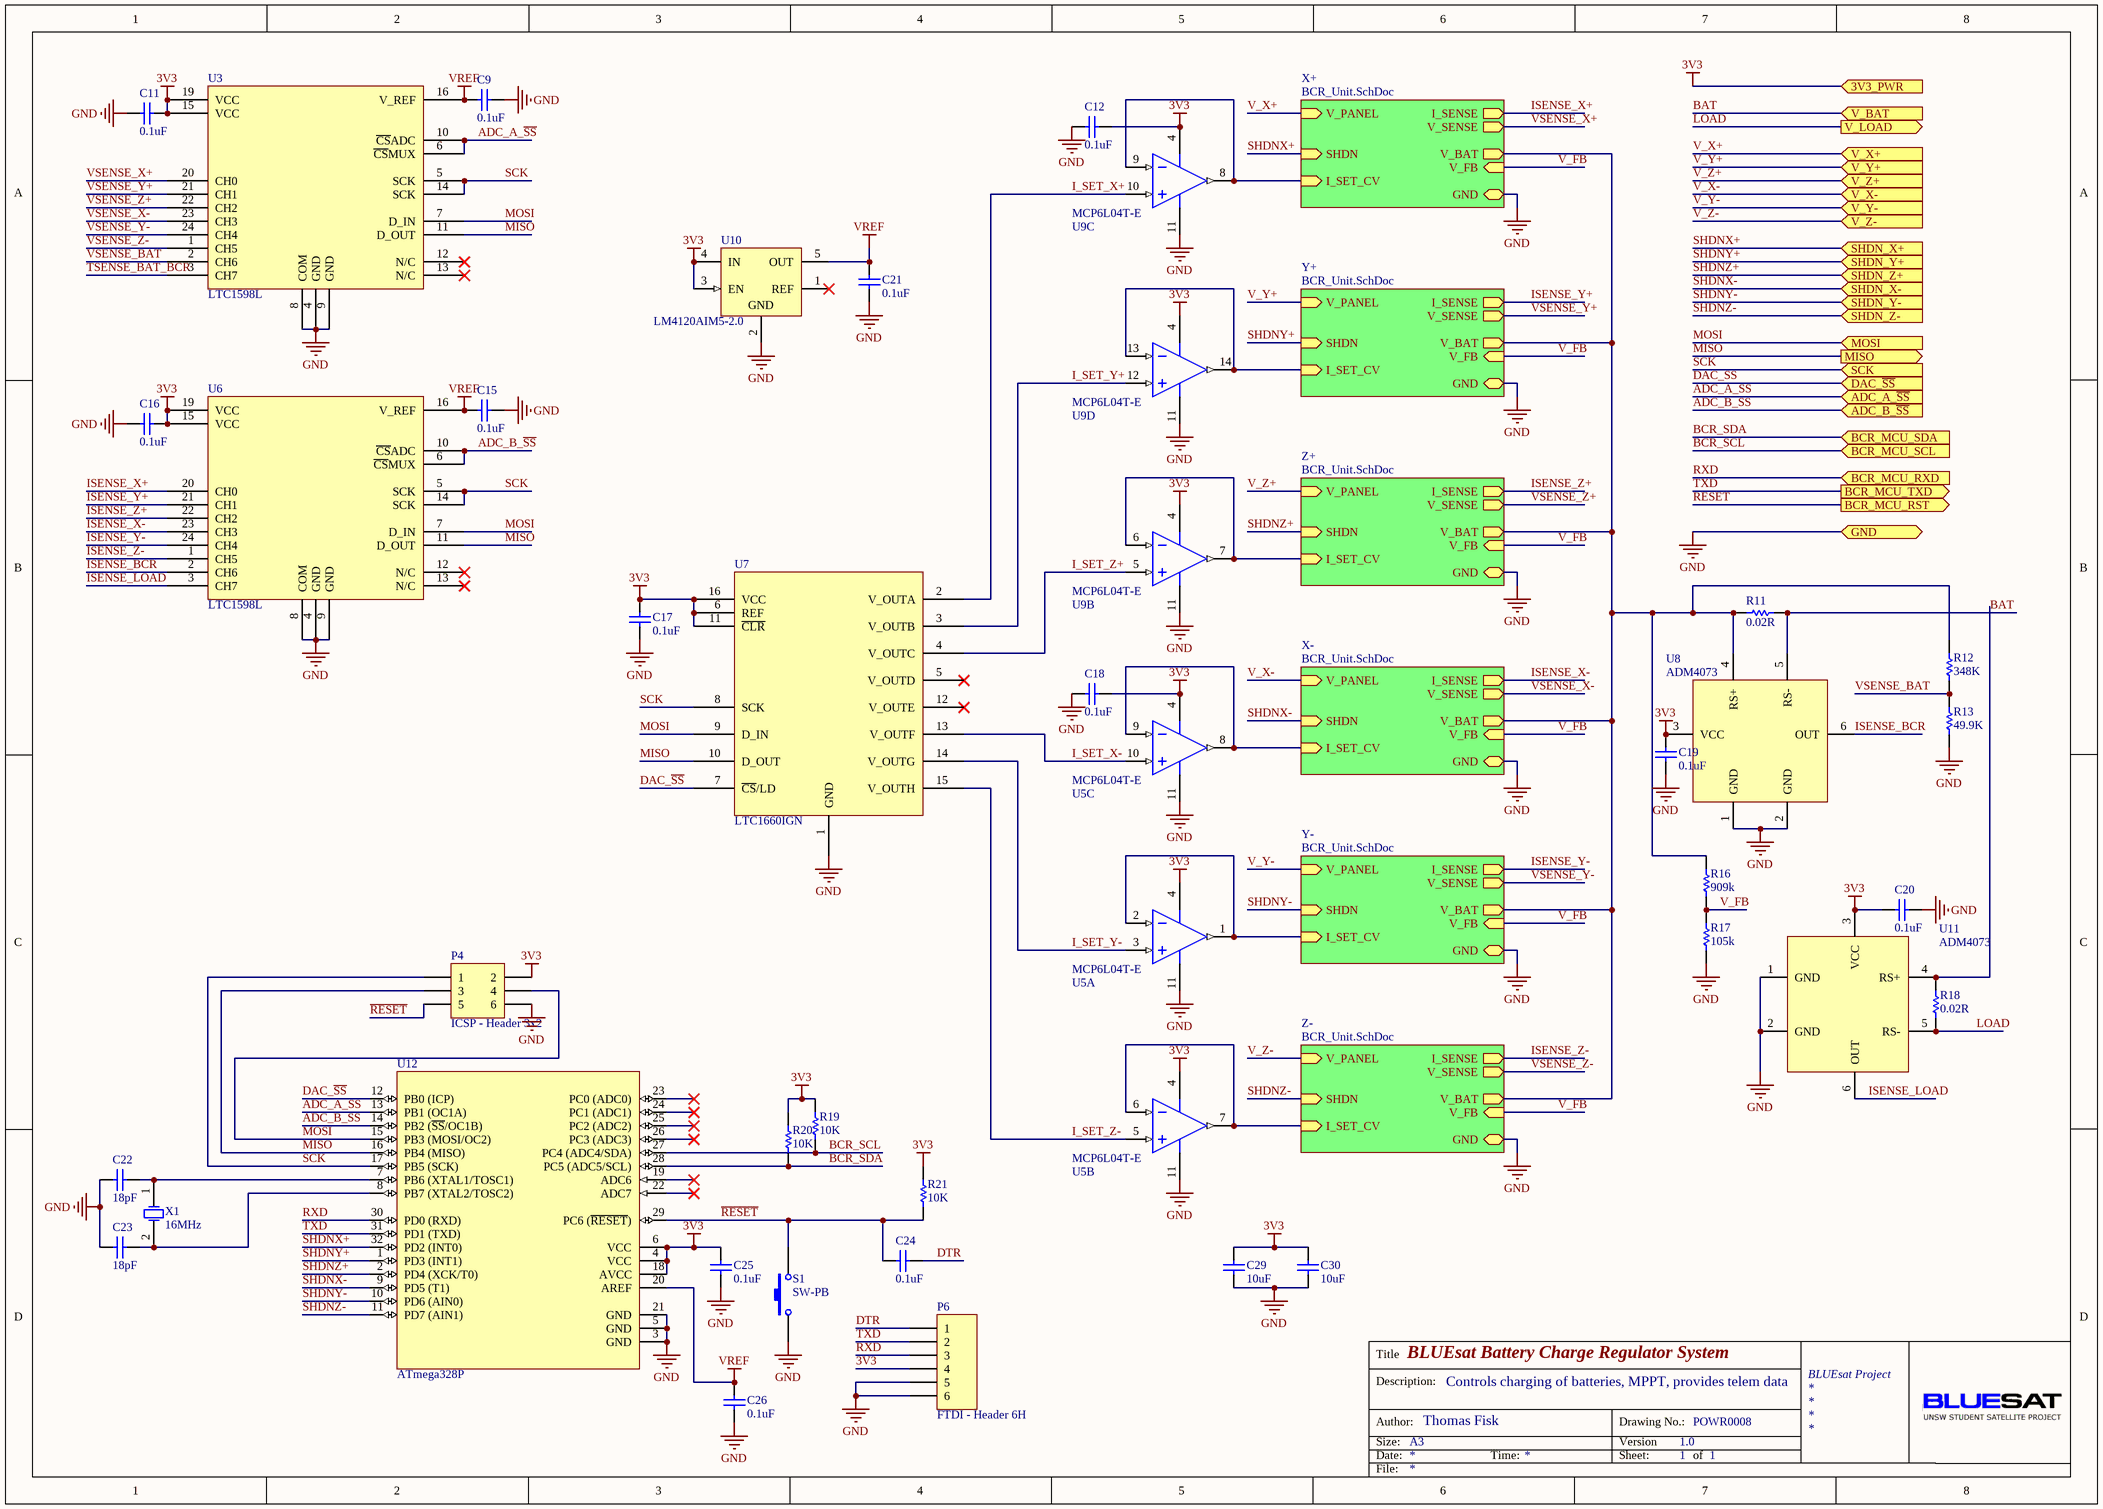
[diagram p5: BCR.SchDoc]

### Parts
(Parts that share a designator on the sheet are numbered #1, #2 ... from top to bottom, then left to right.)
C9  value 0.1uF  [CAPC2012M]  (hidden comment: Cap)
C11  value 0.1uF  [CAPC2012M]  (hidden comment: Cap)
C12  value 0.1uF  [CAPC2012M]  (hidden comment: Cap)
C15  value 0.1uF  [CAPC2012M]  (hidden comment: Cap)
C16  value 0.1uF  [CAPC2012M]  (hidden comment: Cap)
C17  value 0.1uF  [CAPC2012M]  (hidden comment: Cap)
C18  value 0.1uF  [CAPC2012M]  (hidden comment: Cap)
C19  value 0.1uF  [CAPC2012M]  (hidden comment: Cap)
C20  value 0.1uF  [CAPC2012M]  (hidden comment: Cap)
C21#2  value 0.1uF  [CAPC2012M]  (hidden comment: Cap)
C22#2  value 18pF  [CAPC2012M]  (hidden comment: Cap)
C23#2  value 18pF  [CAPC2012M]  (hidden comment: Cap)
C24#2  value 0.1uF  [CAPC2012M]  (hidden comment: Cap)
C25  value 0.1uF  [CAPC2012M]  (hidden comment: Cap)
C26  value 0.1uF  [CAPC2012M]  (hidden comment: Cap)
C29  value 10uF  [CAPC3216M]  (hidden comment: Cap)
C30  value 10uF  [CAPC3216M]  (hidden comment: Cap)
P4  ICSP - Header 3x2  [HDR2X3]
P6  FTDI - Header 6H  [HDR1X6H]
R11  value 0.02R  [RESC2012M]  (hidden comment: 0805 Resistor)
R12#2  value 348K  [RESC2012M]  (hidden comment: Res1)
R13#2  value 49.9K  [RESC2012M]  (hidden comment: Res1)
R16  value 909k  [RESC2012M]  (hidden comment: Res1)
R17  value 105k  [RESC2012M]  (hidden comment: Res1)
R18  value 0.02R  [RESC2012M]  (hidden comment: 0805 Resistor)
R19  value 10K  [RESC2012M]  (hidden comment: Res1)
R20  value 10K  [RESC2012M]  (hidden comment: Res1)
R21  value 10K  [RESC2012M]  (hidden comment: Res1)
S1  SW-PB  [RESET SWITCH]
U3  LTC1598L  [LTC1598L]
U5  MCP6L04T-E  [MTC14_N]  (parts A,B,C of 4)
U6  LTC1598L  [LTC1598L]
U7  LTC1660IGN  [LTC1660]
U8  ADM4073  [SOT95P285X145-6N]
U9  MCP6L04T-E  [MTC14_N]  (parts B,C,D of 4)
U10  LM4120AIM5-2.0  [MF05A_N]
U11  ADM4073  [SOT95P285X145-6N]
U12  ATmega328P  [32A_N]
X1  16MHz  [HC49 - No border]

### Sub-sheets
X+ = BCR_Unit.SchDoc: I_SET_CV (in), V_BAT (out), SHDN (in), V_FB (in), V_SENSE (out), I_SENSE (out), V_PANEL (in), GND
X- = BCR_Unit.SchDoc: I_SET_CV (in), V_BAT (out), SHDN (in), V_FB (in), V_SENSE (out), I_SENSE (out), V_PANEL (in), GND
Y+ = BCR_Unit.SchDoc: I_SET_CV (in), V_BAT (out), SHDN (in), V_FB (in), V_SENSE (out), I_SENSE (out), GND, V_PANEL (in)
Y- = BCR_Unit.SchDoc: I_SET_CV (in), V_BAT (out), SHDN (in), V_FB (in), V_SENSE (out), I_SENSE (out), V_PANEL (in), GND
Z+ = BCR_Unit.SchDoc: I_SET_CV (in), V_BAT (out), SHDN (in), V_FB (in), V_SENSE (out), I_SENSE (out), V_PANEL (in), GND
Z- = BCR_Unit.SchDoc: I_SET_CV (in), V_BAT (out), SHDN (in), V_FB (in), V_SENSE (out), I_SENSE (out), V_PANEL (in), GND

### Ports
3V3_PWR (in), ADC_A_~{SS} (in), ADC_B_~{SS} (in), BCR_MCU_RST (out), BCR_MCU_RXD (in), BCR_MCU_SCL (in), BCR_MCU_SDA (in), BCR_MCU_TXD (out), DAC_~{SS} (in), GND, MISO (out), MOSI (in), SCK (in), SHDN_X+ (in), SHDN_X- (in), SHDN_Y+ (in), SHDN_Y- (in), SHDN_Z+ (in), SHDN_Z- (in), V_BAT (in), V_LOAD (out), V_X+ (in), V_X- (in), V_Y+ (in), V_Y- (in), V_Z+ (in), V_Z- (in)

### Nets
3V3: C11.2 C12.2 C16.2 C17.2 C18.2 C19.1 C20.1 C25.2 C29.2 C30.2 P4.2 P6.4 R19.1 R20.1 R21.1 U3.15(VCC) U3.19(VCC) U5.4(V+) U6.15(VCC) U6.19(VCC) U7.6(REF) U7.11(~{CLR}) U7.16(VCC) U8.3(VCC) U9.4(V+) U10.3(EN) U10.4(IN) U11.3(VCC) U12.4(VCC) U12.6(VCC) U12.18(AVCC) ; port 3V3_PWR
GND: C9.1 C11.1 C12.1 C15.1 C16.1 C17.1 C18.1 C19.2 C20.2 C21#2.1 C22#2.1 C23#2.1 C25.1 C26.2 C29.1 C30.1 P4.6 P6.5 P6.6 R13#2.2 R17.1 S1.1 U3.4(GND) U3.8(COM) U3.9(GND) U5.11(V-) U6.4(GND) U6.8(COM) U6.9(GND) U7.1(GND) U8.1(GND) U8.2(GND) U9.11(V-) U10.2(GND) U11.1(GND) U11.2(GND) U12.3(GND) U12.5(GND) U12.21(GND) ; port GND, sheet X+/GND, sheet Y+/GND, sheet Z+/GND, sheet X-/GND, sheet Y-/GND, sheet Z-/GND
VREF: C9.2 C15.2 C21#2.2 C26.1 U3.16(V_REF) U6.16(V_REF) U10.5(OUT) U12.20(AREF)
ADC_A_~{SS}: U3.6(~{CS}MUX) U3.10(~{CS}ADC) U12.13(PB1_(OC1A)) ; port ADC_A_~{SS}
ADC_B_~{SS}: U6.6(~{CS}MUX) U6.10(~{CS}ADC) U12.14(PB2_(~{SS}/OC1B)) ; port ADC_B_~{SS}
BAT: R11.2 R18.2 U8.5(RS-) U11.4(RS+) ; port V_BAT
BCR_SCL: R19.2 U12.27(PC4_(ADC4/SDA)) ; port BCR_MCU_SCL
BCR_SDA: R20.2 U12.28(PC5_(ADC5/SCL)) ; port BCR_MCU_SDA
DAC_~{SS}: U7.7(~{CS}/LD) U12.12(PB0_(ICP)) ; port DAC_~{SS}
DTR: C24#2.1 P6.1
I_SET_CV: U5.1(OUTA) U5.2(INA-) ; sheet Y-/I_SET_CV
I_SET_CV: U5.6(INB-) U5.7(OUTB) ; sheet Z-/I_SET_CV  [a separate net that carries the same name]
I_SET_CV: U5.8(OUTC) U5.9(INC-) ; sheet X-/I_SET_CV  [a separate net that carries the same name]
I_SET_CV: U9.13(IND-) U9.14(OUTD) ; sheet Y+/I_SET_CV  [a separate net that carries the same name]
I_SET_CV: U9.6(INB-) U9.7(OUTB) ; sheet Z+/I_SET_CV  [a separate net that carries the same name]
I_SET_CV: U9.8(OUTC) U9.9(INC-) ; sheet X+/I_SET_CV  [a separate net that carries the same name]
I_SET_X+: U7.2(V_OUTA) U9.10(INC+)
I_SET_X-: U5.10(INC+) U7.13(V_OUTF)
I_SET_Y+: U7.3(V_OUTB) U9.12(IND+)
I_SET_Y-: U5.3(INA+) U7.14(V_OUTG)
I_SET_Z+: U7.4(V_OUTC) U9.5(INB+)
I_SET_Z-: U5.5(INB+) U7.15(V_OUTH)
ISENSE_BCR: U6.2(CH6) U8.6(OUT)
ISENSE_LOAD: U6.3(CH7) U11.6(OUT)
ISENSE_X+: U6.20(CH0) ; sheet X+/I_SENSE
ISENSE_X-: U6.23(CH3) ; sheet X-/I_SENSE
ISENSE_Y+: U6.21(CH1) ; sheet Y+/I_SENSE
ISENSE_Y-: U6.24(CH4) ; sheet Y-/I_SENSE
ISENSE_Z+: U6.22(CH2) ; sheet Z+/I_SENSE
ISENSE_Z-: U6.1(CH5) ; sheet Z-/I_SENSE
LOAD: R18.1 U11.5(RS-) ; port V_LOAD
MISO: P4.3 U3.11(D_OUT) U6.11(D_OUT) U7.10(D_OUT) U12.16(PB4_(MISO)) ; port MISO
MOSI: P4.4 U3.7(D_IN) U6.7(D_IN) U7.9(D_IN) U12.15(PB3_(MOSI/OC2)) ; port MOSI
~{RESET}: C24#2.2 P4.5 R21.2 S1.2 U12.29(PC6_(~{RESET})) ; port BCR_MCU_RST
RXD: P6.3 U12.30(PD0_(RXD)) ; port BCR_MCU_RXD
SCK: P4.1 U3.5(SCK) U3.14(SCK) U6.5(SCK) U6.14(SCK) U7.8(SCK) U12.17(PB5_(SCK)) ; port SCK
SHDNX+: U12.32(PD2_(INT0)) ; port SHDN_X+, sheet X+/SHDN
SHDNX-: U12.9(PD5_(T1)) ; port SHDN_X-, sheet X-/SHDN
SHDNY+: U12.1(PD3_(INT1)) ; port SHDN_Y+, sheet Y+/SHDN
SHDNY-: U12.10(PD6_(AIN0)) ; port SHDN_Y-, sheet Y-/SHDN
SHDNZ+: U12.2(PD4_(XCK/T0)) ; port SHDN_Z+, sheet Z+/SHDN
SHDNZ-: U12.11(PD7_(AIN1)) ; port SHDN_Z-, sheet Z-/SHDN
TSENSE_BAT_BCR: U3.3(CH7)
TXD: P6.2 U12.31(PD1_(TXD)) ; port BCR_MCU_TXD
V_FB: R16.1 R17.2 ; sheet X+/V_FB, sheet Y+/V_FB, sheet Z+/V_FB, sheet X-/V_FB, sheet Y-/V_FB, sheet Z-/V_FB
V_X+: port V_X+, sheet X+/V_PANEL
V_X-: port V_X-, sheet X-/V_PANEL
V_Y+: port V_Y+, sheet Y+/V_PANEL
V_Y-: port V_Y-, sheet Y-/V_PANEL
V_Z+: port V_Z+, sheet Z+/V_PANEL
V_Z-: port V_Z-, sheet Z-/V_PANEL
VSENSE_BAT: R12#2.2 R13#2.1 U3.2(CH6)
VSENSE_X+: U3.20(CH0) ; sheet X+/V_SENSE
VSENSE_X-: U3.23(CH3) ; sheet X-/V_SENSE
VSENSE_Y+: U3.21(CH1) ; sheet Y+/V_SENSE
VSENSE_Y-: U3.24(CH4) ; sheet Y-/V_SENSE
VSENSE_Z+: U3.22(CH2) ; sheet Z+/V_SENSE
VSENSE_Z-: U3.1(CH5) ; sheet Z-/V_SENSE
NetC6_X+_1: R11.1 R12#2.1 R16.2 U8.4(RS+) ; sheet X+/V_BAT, sheet Y+/V_BAT, sheet Z+/V_BAT, sheet X-/V_BAT, sheet Y-/V_BAT, sheet Z-/V_BAT
NetC22#2_2: C22#2.2 U12.7(PB6_(XTAL1/TOSC1)) X1.1(OSC1)
NetC23#2_2: C23#2.2 U12.8(PB7_(XTAL2/TOSC2)) X1.2(OSC2)

Not connected (* = marked no-connect by the designer): U3 12(N/C)* 13(N/C)*; U6 12(N/C)* 13(N/C)*; U7 5(V_OUTD)* 12(V_OUTE)*; U10 1(REF)*; U12 19(ADC6)* 22(ADC7)* 23(PC0_(ADC0))* 24(PC1_(ADC1))* 25(PC2_(ADC2))* 26(PC3_(ADC3))*

### Notes on the sheet
- Title
- Description:
- Size:
- Author:
- Date:
- A3
- Time:
- Version
- Sheet:
- Drawing No.:
- of
- File:

### Library data of the parts
C9 C11 C12 C15-C20 C21#2 C22#2 C23#2 C24#2 C25 C26 C29 C30 = Cap: Capacitor; Published: 8-Jun-2000; LatestRevisionDate: 17-Jul-2002; LatestRevisionNote: Re-released for DXP Platform.; PackageReference: RAD-0.3; Publisher: Altium Limited; PackageDescription: Radial Cap, Thru-Hole; 2 Leads; 0.3 in Pin Spacing; Supplier 1: Farnell; Supplier 2: Farnell; Supplier Part Number 2: 1759265
P4 = Header 3X2: Header, 3-Pin, Dual row; LatestRevisionDate: 17-Jul-2002; LatestRevisionNote: Re-released for DXP Platform.; Publisher: Altium Limited
P6 = Header 6H: Header, 6-Pin, Right Angle; LatestRevisionDate: 17-Jul-2002; LatestRevisionNote: Re-released for DXP Platform.; Publisher: Altium Limited
R11 R12#2 R13#2 R16-R21 = Res1: Resistor; Published: 8-Jun-2000; LatestRevisionDate: 17-Jul-2002; LatestRevisionNote: Re-released for DXP Platform.; PackageReference: AXIAL-0.3; Publisher: Altium Limited; PackageDescription: Axial Device, Thru-Hole; 2 Leads; 0.3 in Pin Spacing; Supplier 1: Farnell
S1 = SW-PB: Switch; Published: 24-Mar-1999; LatestRevisionDate: 17-Jul-2002; LatestRevisionNote: Re-released for DXP Platform.; PackageReference: SPST-2; Publisher: Altium Limited; PackageDescription: Switch; 2 Leads
U5 U9 = LMV554MT: 3 MHz, Micropower RRO Amplifier; Manufacturer: National Semiconductor; CompType: Amplifiers; PackageTopMarking: NSUZXYTT*LMV55*4MT; PowerWise: Y; Published: 4-Dec-2008; LatestRevisionDate: 13-Jan-2009; LatestRevisionNote: Sim Model Added.; DatasheetVersion: Aug-2008; PackageVersion: revD, Jun-2003; PackageReference: MTC14; Publisher: Altium Limited; PackageDescription: Molded TSSOP, JEDEC, 5 x 4.4 x 0.9mm Body, 14 Lead, 0.65mm Pitch; PartNumber: LMV554MT; RoHS: Y; PinCount: 14; DigiKeyPartNumber: LMV554MT-ND; Code_JEDEC: MO-153-AB-1; ComponentLink1Description: LMV554 Datasheet; ComponentLink1URL: http://www.national.com/ds/LM/LMV554.pdf; ComponentLink2Description: LMV554 Web Page; ComponentLink2URL: http://www.national.com/pf/LM/LMV554.html; ComponentLink3Description: MTC14 Package Page; ComponentLink3URL: http://www.national.com/packaging/folders/mtc14.html
U8 U11 = ADM4073: Current Sense Amplifer
U10 = LM4120AIM5-2.0: Precision Micropower Low Dropout Voltage Reference; Manufacturer: National Semiconductor; CompType: Voltage Reference IC; PackageTopMarking: R14A*XTT; PowerWise: Y; Published: 4-Dec-2008; DatasheetVersion: Mar-2005; PackageVersion: revD, Aug-2008; PackageReference: MF05A; Publisher: Altium Limited; PackageDescription: Molded SOT-23, .115 x .063 x .040 in Body, 5 Lead, .0375 in Pitch; PartNumber: LM4120AIM5-2.0; RoHS: O; PinCount: 5; DigiKeyPartNumber: LM4120AIM5-2.0CT-ND; ComponentLink1Description: LM4120 Datasheet; ComponentLink1URL: http://www.national.com/ds/LM/LM4120.pdf; ComponentLink2Description: LM4120 Web Page; ComponentLink2URL: http://www.national.com/pf/LM/LM4120.html; ComponentLink3Description: MF05A Package Page; ComponentLink3URL: http://www.national.com/packaging/folders/mf05a.html
U12 = ATmega8-16AC: 8-Bit AVR Microcontroller with 8K Bytes of In-System Programmable Flash Memory; Published: 17-Sep-2003; LatestRevisionDate: 13-Apr-2006; LatestRevisionNote: IPC-7351 Footprint Added.; DatasheetVersion: 2486H-AVR-09/02; PackageVersion: revB, Oct-2001; PackageReference: 32A; Publisher: Altium Limited; PackageDescription: 32-Pin Thin Quad Flat Pack 0.8 mm Pitch; Code_JEDEC: MS-026-ABA; ComponentLink1Description: Manufacturer Link; ComponentLink1URL: http://www.atmel.com; ComponentLink2Description: Datasheet; ComponentLink2URL: http://www.atmel.com/dyn/resources/prod_documents/doc2486.pdf
X1 = ECS-110-S-5P: Crystal Oscillator; Published: 17-Jul-2002; DatasheetDocument: 18-Apr-2000; PackageReference: CSM-7; Publisher: Altium Limited; ComponentLink1Description: Manufacturer Link; ComponentLink1URL: http://www.ecsxtal.com/; ComponentLink2Description: Datasheet; ComponentLink2URL: http://www.ecsxtal.com/pdf3/CSM_7.pdf

## Sheet BCR_Unit.SchDoc: BLUEsat Battery Charge Regulator
size A3; Engineer: T. FISK; Organization: BLUEsat Project; Address1: Room 419; Address2: School of EE&T; Address3: UNSW, NSW 2052; Address4: Australia; DocumentNumber: POWR0001; SheetNumber: 1; SheetTotal: 1; Description: Battery charge regulator based on LT1513-2; Version: 4
Used 6 times, as channels Power/BCR/X+, Power/BCR/Y+, Power/BCR/Z+, Power/BCR/X-, Power/BCR/Y-, Power/BCR/Z-. Parts and nets are listed once, with the designators drawn on the sheet.
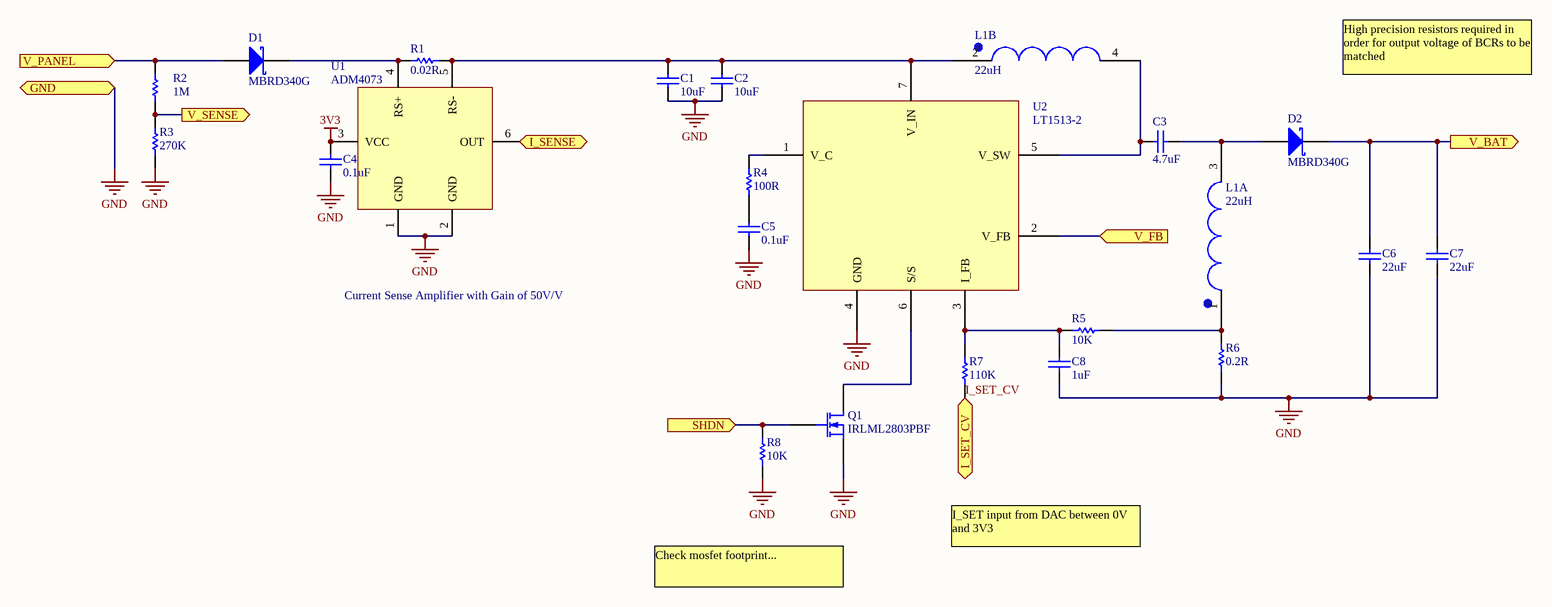
[diagram p6: BCR_Unit.SchDoc]

### Parts
C1  value 10uF  [CAPC3225M]  (hidden comment: Cap)
C2  value 10uF  [CAPC3225M]  (hidden comment: Cap)
C3  value 4.7uF  [CAPC3225M]  (hidden comment: Cap)
C4  value 0.1uF  [CAPC2012M]  (hidden comment: Cap)
C5  value 0.1uF  [CAPC2012M]  (hidden comment: Cap)
C6  value 22uF  [CAPC4532M]  (hidden comment: Cap)
C7  value 22uF  [CAPC4532M]  (hidden comment: Cap)
C8  value 1uF  [CAPC2012M]  (hidden comment: Cap)
D1  MBRD340G  [TO229P990X238-3N]
D2  MBRD340G  [TO229P990X238-3N]
L1  value 22uH  [DRQ125]  (hidden comment: DRQ125 Dual Inductor)  (parts A,B of 2)
Q1  IRLML2803PBF  [SOT-23_N]
R1  value 0.02R  [RESC2012M]  (hidden comment: Res1)
R2  value 1M  [RESC2012M]  (hidden comment: Res1)
R3  value 270K  [RESC2012M]  (hidden comment: Res1)
R4  value 100R  [RESC2012M]  (hidden comment: Res1)
R5  value 10K  [RESC2012M]  (hidden comment: Res1)
R6  value 0.2R  [RESC2012M]  (hidden comment: Res1)
R7  value 110K  [RESC2012M]  (hidden comment: Res1)
R8  value 10K  [RESC2012M]  (hidden comment: Res1)
U1  ADM4073  [SOT95P285X145-6N]
U2  LT1513-2  [TO152P1396X238-8N]

### Ports
GND, I_SENSE (out), I_SET_CV (in), SHDN (in), V_BAT (out), V_FB (in), V_PANEL (in), V_SENSE (out)

### Nets
3V3: C4.1 U1.3(VCC)
GND: C1.2 C2.2 C4.2 C5.2 C6.2 C7.2 C8.1 Q1.3(S) R3.2 R6.1 R8.2 U1.1(GND) U1.2(GND) U2.4(GND) ; port GND
I_SENSE: U1.6(OUT) ; port I_SENSE
I_SET_CV: R7.2 ; port I_SET_CV
SHDN: Q1.2(G) R8.1 ; port SHDN
V_BAT: C6.1 C7.1 D2.2(K) ; port V_BAT
V_FB: U2.2(V_FB) ; port V_FB
V_PANEL: D1.1(A) R2.1 ; port V_PANEL
V_SENSE: R2.2 R3.1 ; port V_SENSE
NetC1_1: C1.1 C2.1 L1.2 R1.1 U1.5(RS-) U2.7(V_IN)
NetC3_1: C3.1 D2.1(A) L1.3
NetC3_2: C3.2 L1.4 U2.5(V_SW)
NetC5_1: C5.1 R4.2
NetC8_2: C8.2 R5.2 R7.1 U2.3(I_FB)
NetD1_2: D1.2(K) R1.2 U1.4(RS+)
NetL1_1: L1.1 R5.1 R6.2
NetQ1_1: Q1.1(D) U2.6(S/S)
NetR4_1: R4.1 U2.1(V_C)

### Channels
Power/BCR/X+: designators end in _X+; ports GND=GND I_SENSE=ISENSE_X+ I_SET_CV=I_SET_CV SHDN=SHDNX+ V_BAT=NetC6_X+_1 V_FB=V_FB V_PANEL=V_X+ V_SENSE=VSENSE_X+
Power/BCR/Y+: designators end in _Y+; ports GND=GND I_SENSE=ISENSE_Y+ I_SET_CV=I_SET_CV SHDN=SHDNY+ V_BAT=NetC6_X+_1 V_FB=V_FB V_PANEL=V_Y+ V_SENSE=VSENSE_Y+
Power/BCR/Z+: designators end in _Z+; ports GND=GND I_SENSE=ISENSE_Z+ I_SET_CV=I_SET_CV SHDN=SHDNZ+ V_BAT=NetC6_X+_1 V_FB=V_FB V_PANEL=V_Z+ V_SENSE=VSENSE_Z+
Power/BCR/X-: designators end in _X-; ports GND=GND I_SENSE=ISENSE_X- I_SET_CV=I_SET_CV SHDN=SHDNX- V_BAT=NetC6_X+_1 V_FB=V_FB V_PANEL=V_X- V_SENSE=VSENSE_X-
Power/BCR/Y-: designators end in _Y-; ports GND=GND I_SENSE=ISENSE_Y- I_SET_CV=I_SET_CV SHDN=SHDNY- V_BAT=NetC6_X+_1 V_FB=V_FB V_PANEL=V_Y- V_SENSE=VSENSE_Y-
Power/BCR/Z-: designators end in _Z-; ports GND=GND I_SENSE=ISENSE_Z- I_SET_CV=I_SET_CV SHDN=SHDNZ- V_BAT=NetC6_X+_1 V_FB=V_FB V_PANEL=V_Z- V_SENSE=VSENSE_Z-

### Notes on the sheet
- High precision resistors required in order for output voltage of BCRs to be matched
- Current Sense Amplifier with Gain of 50V/V
- I_SET input from DAC between 0V and 3V3
- Check mosfet footprint...
- Title
- Size:
- Date:
- A3
- Number:
- Time:
- Revision:
- Sheet
- of
- File:

### Library data of the parts
C1-C8 = Cap: Capacitor; Published: 8-Jun-2000; LatestRevisionDate: 17-Jul-2002; LatestRevisionNote: Re-released for DXP Platform.; PackageReference: RAD-0.3; Publisher: Altium Limited; PackageDescription: Radial Cap, Thru-Hole; 2 Leads; 0.3 in Pin Spacing; Supplier 1: Farnell; Supplier 2: Farnell
  C1 C2: Supplier Part Number 2: 1844365
  C3: Supplier Part Number 2: 1844381
  C4 C5: Supplier Part Number 2: 1759265
  C6 C7: Supplier Part Number 2: 1844378
  C8: Supplier Part Number 2: 1168132
D1 D2 = Diode 11DQ03: Schottky Rectifier; Published: 8-Jun-2000; LatestRevisionDate: 17-Jul-2002; LatestRevisionNote: Re-released for DXP Platform.; DatasheetVersion: Dec-1997; PackageReference: DO-204AL; Publisher: Altium Limited; PackageDescription: Diode, Axial; Body 5.2 x 2.7 mm (LxDia. max), Lead Dia. 0.86 mm (max); Code_JEDEC: DO-204-AL; ComponentLink1Description: Manufacturer Link; ComponentLink1URL: http://www.irf.com/; ComponentLink2Description: Datasheet; ComponentLink2URL: http://www.irf.com/product-info/datasheets/data/11dq03.pdf; Supplier 1: Farnell; Supplier Part Number 1: 1431096
Q1 = MOSFET-N: N-Channel MOSFET; pin to pad: 1>3 2>1 3>2; Published: 8-Jun-2000; LatestRevisionDate: 17-Jul-2002; LatestRevisionNote: Re-released for DXP Platform.; PackageVersion: 1995/1996; PackageReference: E3; Publisher: Altium Limited; PackageDescription: TO, Flat Index; 3 In-Line, Axial Leads; Body Dia. 4.6mm; Lead Dia. 0.5 mm (max)
R1-R8 = Res1: Resistor; Published: 8-Jun-2000; LatestRevisionDate: 17-Jul-2002; LatestRevisionNote: Re-released for DXP Platform.; PackageReference: AXIAL-0.3; Publisher: Altium Limited; PackageDescription: Axial Device, Thru-Hole; 2 Leads; 0.3 in Pin Spacing; Supplier 1: Farnell
U1 = ADM4073: Current Sense Amplifer
U2 = LT1513: Supplier 1: Farnell; Supplier Part Number 1: 1648008

## Nets that join several sheets
3V3_PWR: Power (R13#1.2 R13_1.2), Power/TRX1 (7 pins), Power/TRX2 (7 pins)
GND: Power (8 pins), Power/LDO_5V0_1 (12 pins), Power/LDO_3V3_1 (12 pins), Power/LDO_5V0_2 (12 pins), Power/LDO_3V3_2 (12 pins), Power/LDO_5V0_3 (12 pins), Power/LDO_3V3_3 (12 pins), Power/LDO_5V0_4 (12 pins), Power/LDO_3V3_4 (12 pins), Power/SW_5V0 (14 pins), Power/SW_3V3 (14 pins), Power/TRX1 (41 pins), Power/TRX2 (41 pins)
GND: BCR (39 pins), Power/BCR/X+ (14 pins), Power/BCR/Y+ (14 pins), Power/BCR/Z+ (14 pins), Power/BCR/X- (14 pins), Power/BCR/Y- (14 pins), Power/BCR/Z- (14 pins)
V_IN: Power/SW_5V0 (8 pins), Power/SW_3V3 (8 pins), Power/TRX1 (17 pins), Power/TRX2 (17 pins)
FB: Power (R26.1 R28.2), Power/SW_5V0 (U1_SW_5V0.9)
FB: Power (R27.1 R29.2), Power/SW_3V3 (U1_SW_3V3.9)
I_SET_CV: BCR (U5.1 U5.2), Power/BCR/Y- (R7_Y-.2)
I_SET_CV: BCR (U5.6 U5.7), Power/BCR/Z- (R7_Z-.2)
I_SET_CV: BCR (U5.8 U5.9), Power/BCR/X- (R7_X-.2)
I_SET_CV: BCR (U9.13 U9.14), Power/BCR/Y+ (R7_Y+.2)
I_SET_CV: BCR (U9.6 U9.7), Power/BCR/Z+ (R7_Z+.2)
I_SET_CV: BCR (U9.8 U9.9), Power/BCR/X+ (R7_X+.2)
ISENSE_X+: BCR (U6.20), Power/BCR/X+ (U1_X+.6)
ISENSE_X-: BCR (U6.23), Power/BCR/X- (U1_X-.6)
ISENSE_Y+: BCR (U6.21), Power/BCR/Y+ (U1_Y+.6)
ISENSE_Y-: BCR (U6.24), Power/BCR/Y- (U1_Y-.6)
ISENSE_Z+: BCR (U6.22), Power/BCR/Z+ (U1_Z+.6)
ISENSE_Z-: BCR (U6.1), Power/BCR/Z- (U1_Z-.6)
NetC6_X+_1: BCR (R11.1 R12#2.1 R16.2 U8.4), Power/BCR/X+ (C6_X+.1 C7_X+.1 D2_X+.2), Power/BCR/Y+ (C6_Y+.1 C7_Y+.1 D2_Y+.2), Power/BCR/Z+ (C6_Z+.1 C7_Z+.1 D2_Z+.2), Power/BCR/X- (C6_X-.1 C7_X-.1 D2_X-.2), Power/BCR/Y- (C6_Y-.1 C7_Y-.1 D2_Y-.2), Power/BCR/Z- (C6_Z-.1 C7_Z-.1 D2_Z-.2)
NetR12#1_2: Power (R12#1.2 R13#1.1), Power/TRX1 (U4_TRX1.5)
NetR12_1_2: Power (R12_1.2 R13_1.1), Power/TRX2 (U4_TRX2.5)
SCL: Power/TRX1 (R14_TRX1.1 U4_TRX1.3), Power/TRX2 (R14_TRX2.1 U4_TRX2.3)
SDA: Power/TRX1 (R15_TRX1.1 U4_TRX1.4), Power/TRX2 (R15_TRX2.1 U4_TRX2.4)
SHDNX+: BCR (U12.32), Power/BCR/X+ (Q1_X+.2 R8_X+.1)
SHDNX-: BCR (U12.9), Power/BCR/X- (Q1_X-.2 R8_X-.1)
SHDNY+: BCR (U12.1), Power/BCR/Y+ (Q1_Y+.2 R8_Y+.1)
SHDNY-: BCR (U12.10), Power/BCR/Y- (Q1_Y-.2 R8_Y-.1)
SHDNZ+: BCR (U12.2), Power/BCR/Z+ (Q1_Z+.2 R8_Z+.1)
SHDNZ-: BCR (U12.11), Power/BCR/Z- (Q1_Z-.2 R8_Z-.1)
V_FB: BCR (R16.1 R17.2), Power/BCR/X+ (U2_X+.2), Power/BCR/Y+ (U2_Y+.2), Power/BCR/Z+ (U2_Z+.2), Power/BCR/X- (U2_X-.2), Power/BCR/Y- (U2_Y-.2), Power/BCR/Z- (U2_Z-.2)
Vout: Power (C21#1.2 C22#1.2 R26.2), Power/LDO_5V0_1 (C1_LDO_5V0_1.2 U1_LDO_5V0_1.6 U1_LDO_5V0_1.7), Power/LDO_5V0_2 (C1_LDO_5V0_2.2 U1_LDO_5V0_2.6 U1_LDO_5V0_2.7), Power/LDO_5V0_3 (C1_LDO_5V0_3.2 U1_LDO_5V0_3.6 U1_LDO_5V0_3.7), Power/LDO_5V0_4 (C1_LDO_5V0_4.2 U1_LDO_5V0_4.6 U1_LDO_5V0_4.7), Power/SW_5V0 (JP3_SW_5V0.2 L1_SW_5V0.2 U1_SW_5V0.19)
Vout: Power (C23#1.2 C24#1.2 R27.2), Power/LDO_3V3_1 (C1_LDO_3V3_1.2 U1_LDO_3V3_1.6 U1_LDO_3V3_1.7), Power/LDO_3V3_2 (C1_LDO_3V3_2.2 U1_LDO_3V3_2.6 U1_LDO_3V3_2.7), Power/LDO_3V3_3 (C1_LDO_3V3_3.2 U1_LDO_3V3_3.6 U1_LDO_3V3_3.7), Power/LDO_3V3_4 (C1_LDO_3V3_4.2 U1_LDO_3V3_4.6 U1_LDO_3V3_4.7), Power/SW_3V3 (JP3_SW_3V3.2 L1_SW_3V3.2 U1_SW_3V3.19)
VSENSE_X+: BCR (U3.20), Power/BCR/X+ (R2_X+.2 R3_X+.1)
VSENSE_X-: BCR (U3.23), Power/BCR/X- (R2_X-.2 R3_X-.1)
VSENSE_Y+: BCR (U3.21), Power/BCR/Y+ (R2_Y+.2 R3_Y+.1)
VSENSE_Y-: BCR (U3.24), Power/BCR/Y- (R2_Y-.2 R3_Y-.1)
VSENSE_Z+: BCR (U3.22), Power/BCR/Z+ (R2_Z+.2 R3_Z+.1)
VSENSE_Z-: BCR (U3.1), Power/BCR/Z- (R2_Z-.2 R3_Z-.1)